# Altium project DykoDAC2.PrjPcb
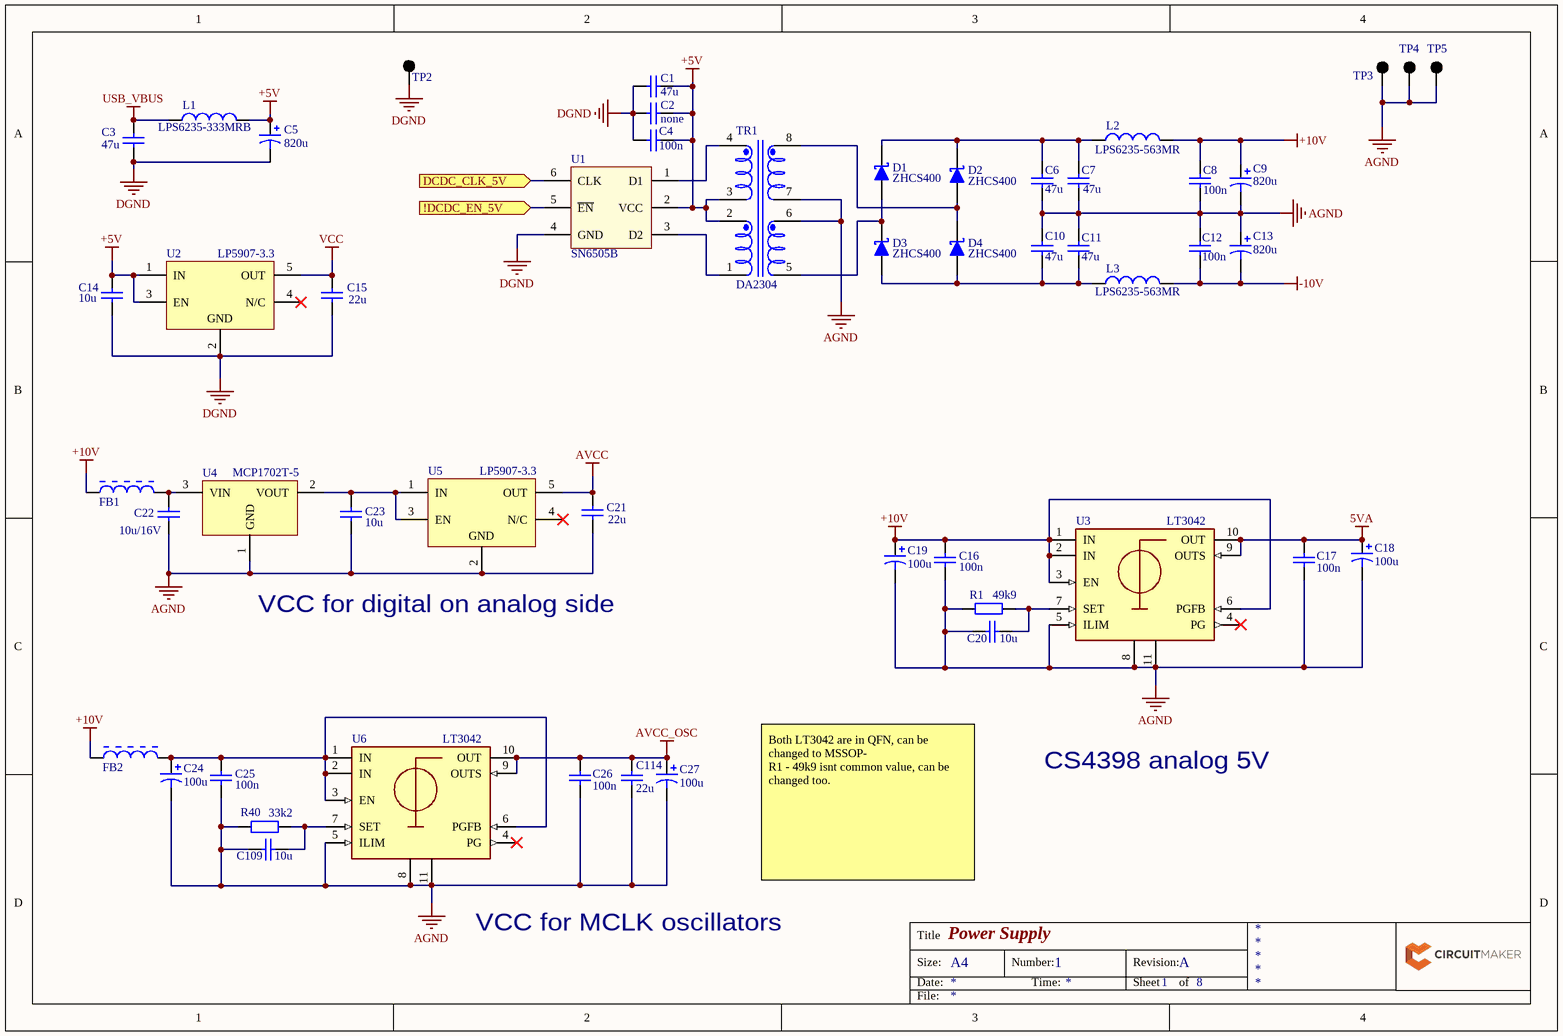
[diagram p0: Power_Supply.SchDoc]
8 sheets, 228 parts. Net scope: flat (ports and power ports of the same name join across sheets).
Sheets:
  Power_Supply.SchDoc
  Power_Supply_9V.SchDoc
  Comm_Interface.SchDoc
  MCU_System.SchDoc
  MCU_GPIO.SchDoc
  MCLK_Oscillator.SchDoc
  CS4398_DAC.SchDoc
  Audio_Output.SchDoc

## Sheet Power_Supply.SchDoc: Power Supply
size A4; DrawnBy: Tomáš Polišenský; DocumentNumber: 1; Revision: A; SheetNumber: 1; SheetTotal: 8; ProjectName: DykoDAC2

### Parts
C1  47u  [PCB-6alau6k4isvsg1wxu4va-1]
C2  none  [PCB-6alau6k4isvsg1wxu4va-1]
C3  47u  [PCB-6alau6k4isvsg1wxu4va-1]
C4  100n  [PCB-rf0pzaa82dpbeu9l4sxm-1]
C5  820u  [A750MS827M1CAAE013]
C6  47u  [PCB-6alau6k4isvsg1wxu4va-1]
C7  47u  [PCB-6alau6k4isvsg1wxu4va-1]
C8  100n  [PCB-rf0pzaa82dpbeu9l4sxm-1]
C9  820u  [A750MS827M1CAAE013]
C10  47u  [PCB-6alau6k4isvsg1wxu4va-1]
C11  47u  [PCB-6alau6k4isvsg1wxu4va-1]
C12  100n  [PCB-rf0pzaa82dpbeu9l4sxm-1]
C13  820u  [A750MS827M1CAAE013]
C14  10u  [PCB-rf0pzaa82dpbeu9l4sxm-1]
C15  22u  [PCB-rf0pzaa82dpbeu9l4sxm-1]
C16  100n  [PCB-rf0pzaa82dpbeu9l4sxm-1]
C17  100n  [PCB-rf0pzaa82dpbeu9l4sxm-1]
C18  100u  [PCB-9bfrndi9huxo1n7cihpl-1]
C19  100u  [PCB-9bfrndi9huxo1n7cihpl-1]
C20  10u  [PCB-rf0pzaa82dpbeu9l4sxm-1]
C21  22u  [PCB-rf0pzaa82dpbeu9l4sxm-1]
C22  10u/16V  [PCB-rf0pzaa82dpbeu9l4sxm-1]
C23  10u  [PCB-rf0pzaa82dpbeu9l4sxm-1]
C24  100u  [PCB-9bfrndi9huxo1n7cihpl-1]
C25  100n  [PCB-rf0pzaa82dpbeu9l4sxm-1]
C26  100n  [PCB-rf0pzaa82dpbeu9l4sxm-1]
C27  100u  [PCB-9bfrndi9huxo1n7cihpl-1]
C109  10u  [PCB-rf0pzaa82dpbeu9l4sxm-1]
C114  22u  [PCB-rf0pzaa82dpbeu9l4sxm-1]
D1  ZHCS400  [PCB-mrclmtn06znaca5ywvvw-1]
D2  ZHCS400  [PCB-mrclmtn06znaca5ywvvw-1]
D3  ZHCS400  [PCB-mrclmtn06znaca5ywvvw-1]
D4  ZHCS400  [PCB-mrclmtn06znaca5ywvvw-1]
FB1  BLM18EG391TN1D  [MURA-BLM18-F-H3-CHIP-2_V]  (value not drawn)
FB2  BLM18EG391TN1D  [MURA-BLM18-F-H3-CHIP-2_V]  (value not drawn)
L1  LPS6235-333MRB  [LPS6235]
L2  LPS6235-563MR  [PCB-91apuy3syfgd6vk6qbo6-1]
L3  LPS6235-563MR  [PCB-91apuy3syfgd6vk6qbo6-1]
R1  49k9  [PCB-3d5y3t7f8drf35yjcj59-1]
R40  33k2  [PCB-3d5y3t7f8drf35yjcj59-1]
TP2  Keystone Electronics 5001  [P1-09]  (value not drawn)
TP3  Keystone Electronics 5001  [P1-09]  (value not drawn)
TP4  Keystone Electronics 5001  [P1-09]  (value not drawn)
TP5  Keystone Electronics 5001  [P1-09]  (value not drawn)
TR1  DA2304  [PCB-wryx25zm61bkpund2vng-1]
U1  SN6505B  [PCB-z49b8x4xdp07datjgpqp-1]
U2  LP5907-3.3  [PCB-ab03it339uw922kmt1cl-1]
U3  LT3042  [PCB-n2zh5wqg9qgt346qmob6-1]
U4  MCP1702T-5  [SOT-23A-CB3_L]
U5  LP5907-3.3  [PCB-ab03it339uw922kmt1cl-1]
U6  LT3042  [PCB-n2zh5wqg9qgt346qmob6-1]

### Ports
!DCDC_EN_5V (in), DCDC_CLK_5V (in)

### Nets
5VA: C17.2 C18.1 U3.9(OUTS) U3.10(OUT)
+5V: C1.1 C2.1 C4.2 C5.1 C14.2 L1.2 TR1.2 TR1.3 U1.2(VCC) U2.1(IN) U2.3(EN)
+10V: C8.2 C9.1 C16.2 C19.1 FB1.1 FB2.1 L2.2 U3.1(IN) U3.2(IN) U3.3(EN) U3.6(PGFB)
-10V: C12.1 C13.2 L3.2
AGND: C6.1 C7.1 C8.1 C9.2 C10.2 C11.2 C12.2 C13.1 C16.1 C17.1 C18.2 C19.2 C20.2 C21.1 C22.1 C23.1 C24.2 C25.1 C26.1 C27.2 C109.2 C114.1 R1.2 R40.2 TP3.1 TP4.1 TP5.1 TR1.6 TR1.7 U3.5(ILIM) U3.8(GND) U3.11(GND) U4.1(GND) U5.2(GND) U6.5(ILIM) U6.8(GND) U6.11(GND)
AVCC: C21.2 U5.5(OUT)
AVCC_OSC: C26.2 C27.1 C114.2 U6.9(OUTS) U6.10(OUT)
DGND: C1.2 C2.2 C3.1 C4.1 C5.2 C14.1 C15.1 TP2.1 U1.4(GND) U2.2(GND)
USB_VBUS: C3.2 L1.1
VCC: C15.2 U2.5(OUT)
!DCDC_EN_5V: U1.5(~{EN}) ; port !DCDC_EN_5V
DCDC_CLK_5V: U1.6(CLK) ; port DCDC_CLK_5V
NetC6_2: C6.2 C7.2 D1.2(K) D2.2(K) L2.1
NetC10_1: C10.1 C11.1 D3.1(A) D4.1(A) L3.1
NetC20_1: C20.1 R1.1 U3.7(SET)
NetC22_2: C22.2 FB1.2 U4.3(VIN)
NetC23_2: C23.2 U4.2(VOUT) U5.1(IN) U5.3(EN)
NetC24_1: C24.1 C25.2 FB2.2 U6.1(IN) U6.2(IN) U6.3(EN) U6.6(PGFB)
NetC109_1: C109.1 R40.1 U6.7(SET)
NetD1_1: D1.1(A) D3.2(K) TR1.5
NetD2_1: D2.1(A) D4.2(K) TR1.8
NetTR1_1: TR1.1 U1.3(D2)
NetTR1_4: TR1.4 U1.1(D1)

Not connected (* = marked no-connect by the designer): U2 4(N/C)*; U3 4(PG)*; U5 4(N/C)*; U6 4(PG)*

### Notes on the sheet
- VCC for digital on analog side
- CS4398 analog 5V
- Both LT3042 are in QFN, can be changed to MSSOP-
  R1 - 49k9 isnt common value, can be changed too.
- (near U6) VCC for MCLK oscillators
- Title
- Size:
- Date:
- A4
- Number:
- Time:
- Revision:
- Sheet
- of
- File:

### Library data of the parts
C1-C3 C6 C7 C10 C11 = CMP-a2006a3718e57dc7-1: 1210 100 uF 16 V ±20% Tolerance X5R SMT Multilayer Ceramic Capacitor; Case/Package: 1210
C4 C8 C12 = CMP-x8hddryxw4o380xfi98v-3: Generic Capacitor 0603; CustomComponentID: x8hddryxw4o380xfi98v; LCSC Part #: C14663
C5 C9 C13 = CMP-1544d833d83eca83-8: Cap Aluminum Polymer 1000uF 16VDC 20% (10 X 12mm) Radial 5mm 0.013 Ohm 5250mA 2000h 105C Bag; Voltage Rating (DC): 16.0 V; Capacitance: 1.00 mF
C14-C17 C20-C23 C25 C26 C109 C114 = CMP-x8hddryxw4o380xfi98v-1: Capacitor 0603; CustomComponentID: x8hddryxw4o380xfi98v
  C14: LCSC Part #: C19702; LCSC Part #: C25804
  C15 C21 C114: LCSC Part #: C59461
  C16 C17 C25 C26: LCSC Part #: C14663
  C20 C23 C109: LCSC Part #: C19702
C18 C19 C24 C27 = CMP-6546a831a81eba81-4: In a Pack of 25, KEMET 100?F Electrolytic Capacitor 10V dc Through Hole - A758EK107M1AAAE016; Capacitance: 100 µF; Equivalent Series Resistance (ESR): 16.0 m?; Voltage Rating (DC): 10.0 V; Capacitance Tolerance: ±20%; Mounting Style: Through Hole; Size-Diameter: 6.30 mm; Size-Height: 8.00 mm; Operating Temperature: 105 °C (max); RoHS: Compliant; Manufacturer Part Number: A758EK107M1AAAE016; Octopart URL: https://octopart.com/a758ek107m1aaae016-kemet-75360318; OctopartID: 6546a831a81eba81
D1-D4 = CMP-3796931-5: Schottky Rectifier, 0.4A, 40V SOD-323; Power Rating: 250 mW; REACH SVHC Compliance: No SVHC; Packaging: Cut Tape (CT); Octopart URL: https://octopart.com/zhcs400-diodes+inc.-13152663; Case/Package: SOD-323; Lifecycle Status: Active; RoHS: Compliant; OctopartID: 21c3e801b532fe04; Manufacturer Part Number: ZHCS400
FB1 FB2 = CMP-1144711-3: Chip Ferrite Bead for GHz Band General Use (Low DC Resistance Type), 390 Ohm, 500 mA, -55 to 125 degC, 1.6 x 0.8 x 0.65 mm SMD, Tape and Reel; Lead-Free Status: Lead Free; Number of Circuits: 1; Resistance: 390.0 Ω; Shielding: No; Manufacturer Part Number: BLM18EG391TN1D; Case/Package: 0603; Mounting Style: Surface Mount; Number of Pins: 2; Octopart Url: https://octopart.com/blm18eg391tn1d-murata-894703; OctopartID: 5b48924fd8c1848f; Packaging: Cut Tape (CT); REACH SVHC Compliance: No SVHC; RoHS: Compliant; Size-Length: 0.0016 m; Size-Width: 0.0008 m
L1 = CMP-f5873d4763982a40-2: Power inductor, shielded, 20% tol, SMT, RoHS, lead-free, halogen-free
L2 L3 = CMP-db2813e84dcb04ef-1: Power inductor, shielded, 20% tol, SMT, RoHS, lead-free, halogen-free; Inductance: 56.0 µH; REACH SVHC Compliance: No SVHC; Packaging: Cut Tape (CT); Lifecycle Status: Active
R1 R40 = CMP-xcu3s4ikiffkkgbeyow5-1: Resistor 0603; CustomComponentID: xcu3s4ikiffkkgbeyow5
TP2-TP5 = CMP-954154-31: KEYSTONE   5001   TEST POINT, PCB, THROUGH HOLE
TR1 = CMP-7cc7b5ab862da300-5: Transformer, for ADM2485, 5-6V, SMT, RoHS; Manufacturer Part Number: DA2303-ALB; Lead-Free Status: Contains Lead; Lifecycle Status: Active; Mounting Style: Surface Mount; OctopartID: 7cc7b5ab862da300; RoHS: Compliant; Octopart URL: https://octopart.com/da2303-alb-coilcraft-6741900
U1 = CMP-a28c686de0427d4b-3: Low-Noise 1 A, 420 kHz Transformer Driver 6-SOT-23 -55 to 125; Manufacturer Part Number: SN6505BDBVT; Lead-Free Status: Lead Free; RoHS: Compliant; Packaging: Cut Tape (CT); Number of Pins: 6; Lifecycle Status: Active; Case/Package: SOT-23; Octopart URL: http://octopart.com/sn6505bdbvr-texas+instruments-65759143; OctopartID: 65ebaf0a272aba2c
U2 U5 = CMP-9de05591815b4227-2: 250mA Ultralow-Noise Low-IQ LDO 4-DSBGA -40 to 125; Manufacturer Part Number: LP5907UVX-3.3/NOPB; Number of Regulated Outputs: 1; Quiescent Current: 12.0 µA; Dropout Voltage: 50.0 mV; Lead-Free Status: Lead Free; Output Capacitor Type: Ceramic; Thermal Shutdown: Yes; RoHS: Compliant; OctopartID: 9de05591815b4227; Octopart URL: http://octopart.com/lp5907uvx-3.3%2Fnopb-texas+instruments-24852957; Lifecycle Status: Active; Packaging: Cut Tape (CT); Mounting Style: Surface Mount
U3 U6 = CMP-ff8235e0d3752045-3: LT3042 - 20V, 200mA, Ultralow Noise, Ultrahigh PSRR RF Linear Regulator; Manufacturer Part Number: LT3042EDD#PBF; Output Voltage: 0.00 V (min), 15.0 V (max); OctopartID: ff8235e0d3752045; Output Current: 200 mA; REACH SVHC Compliance: No SVHC; Octopart URL: http://octopart.com/lt3042edd%23pbf-linear+technology-57149841; RoHS: Compliant; Case/Package: DFN; Number of Pins: 10
U4 = CMP-1493251-3: 250 mA Low Quiescent Current LDO Regulator, 3-Pin SOT-23A, Extended Temperature, Tape and Reel; Manufacturer Part Number: MCP1702T-5002E/CB; Dropout Voltage: 0.625 V; Lead-Free Status: Lead Free; Number of Outputs: 1; Output Voltage: 5.0 V; Quiescent Current: 2e-06 A; Lifecycle Status: Active; Mounting Style: Surface Mount; Number of Pins: 3; Octopart Url: https://octopart.com/mcp1702t-5002e%2Fcb-microchip-535771; OctopartID: c0f809fac9451f3f; Packaging: Tape & Reel (TR); REACH SVHC Compliance: No SVHC; RoHS: Compliant

## Sheet Power_Supply_9V.SchDoc: +/- 9V LDOs
size A4; DocumentNumber: 2; SheetNumber: 2; SheetTotal: 8
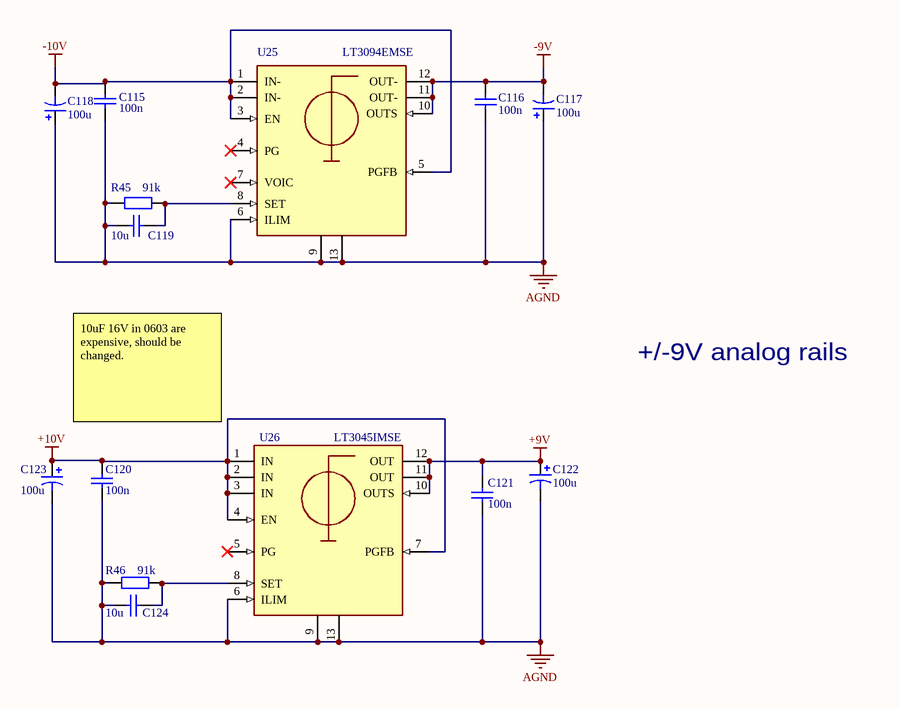
[diagram p1: Power_Supply_9V.SchDoc]

### Parts
C115  100n  [PCB-rf0pzaa82dpbeu9l4sxm-1]
C116  100n  [PCB-rf0pzaa82dpbeu9l4sxm-1]
C117  100u  [PCB-9bfrndi9huxo1n7cihpl-1]
C118  100u  [PCB-9bfrndi9huxo1n7cihpl-1]
C119  10u  [PCB-rf0pzaa82dpbeu9l4sxm-1]
C120  100n  [PCB-rf0pzaa82dpbeu9l4sxm-1]
C121  100n  [PCB-rf0pzaa82dpbeu9l4sxm-1]
C122  100u  [PCB-9bfrndi9huxo1n7cihpl-1]
C123  100u  [PCB-9bfrndi9huxo1n7cihpl-1]
C124  10u  [PCB-rf0pzaa82dpbeu9l4sxm-1]
R45  91k  [PCB-3d5y3t7f8drf35yjcj59-1]
R46  91k  [PCB-3d5y3t7f8drf35yjcj59-1]
U25  LT3094EMSE  [PCB-wizual0g3wynqnqrtsvy-1]
U26  LT3045IMSE  [PCB-wov5llpgebpq1pwypz48-1]

### Nets
+9V: C121.2 C122.1 U26.10(OUTS) U26.11(OUT) U26.12(OUT)
+10V: C120.2 C123.1 U26.1(IN) U26.2(IN) U26.3(IN) U26.4(EN) U26.7(PGFB)
-9V: C116.2 C117.2 U25.10(OUTS) U25.11(OUT-) U25.12(OUT-)
-10V: C115.2 C118.2 U25.1(IN-) U25.2(IN-) U25.3(EN) U25.5(PGFB)
AGND: C115.1 C116.1 C117.1 C118.1 C119.2 C120.1 C121.1 C122.2 C123.2 C124.2 R45.2 R46.2 U25.6(ILIM) U25.9(GND) U25.13(GND) U26.6(ILIM) U26.9(GND) U26.13(GND)
NetC119_1: C119.1 R45.1 U25.8(SET)
NetC124_1: C124.1 R46.1 U26.8(SET)

Not connected (* = marked no-connect by the designer): U25 4(PG)* 7(VOIC)*; U26 5(PG)*

### Notes on the sheet
- 10uF 16V in 0603 are expensive, should be changed.
- +/-9V analog rails
- Title
- Size:
- Date:
- A4
- Number:
- Time:
- Revision:
- Sheet
- of
- File:

### Library data of the parts
C115 C116 C119-C121 C124 = CMP-x8hddryxw4o380xfi98v-1: Capacitor 0603; CustomComponentID: x8hddryxw4o380xfi98v; LCSC Part #: C19702
  C115 C116 C120 C121: LCSC Part #: C14663; LCSC Part #: C109474
  C119 C124: LCSC Part #: C25804; LCSC Part #: C21190; LCSC Part #: C81598; LCSC Part #: C1546
C117 C118 C122 C123 = CMP-6546a831a81eba81-4: as C18 on sheet Power_Supply; Mounting Style: Through Hole; Size-Diameter: 6.30 mm; Size-Height: 8.00 mm; Operating Temperature: 105 °C (max); RoHS: Compliant; Manufacturer Part Number: A758EK107M1AAAE016; Octopart URL: https://octopart.com/a758ek107m1aaae016-kemet-75360318; OctopartID: 6546a831a81eba81
R45 R46 = CMP-xcu3s4ikiffkkgbeyow5-1: Resistor 0603; CustomComponentID: xcu3s4ikiffkkgbeyow5; LCSC Part #: C23265; LCSC Part #: C23345
U25 = CMP-cc5900e31f81139e-11: LDO Regulator Neg 0V to -19.5V 0.5A 12-Pin MSOP EP Tube; Manufacturer Part Number: LT3094EMSE#PBF; Lead-Free Status: Contains Lead; Octopart URL: https://octopart.com/lt3094emse%23pbf-analog+devices-95403590; Number of Pins: 12; Lifecycle Status: Active; RoHS: Compliant; OctopartID: a88b642e33ab774c
U26 = CMP-53899e0384ae8c4e-10: LDO Regulator Pos 0V to 20V 0.5A Automotive 12-Pin MSOP EP Tube; Manufacturer Part Number: LT3045IMSE#PBF; Lead-Free Status: Contains Lead; Output Current: 500 mA; RoHS: Compliant; OctopartID: 53899e0384ae8c4e; Octopart URL: https://octopart.com/lt3045imse%23pbf-analog+devices+%2F+linear+technology-75559489; Lifecycle Status: Active; Operating Temperature: -40.0 °C (min); Case/Package: MSOP; Number of Pins: 12

## Sheet Comm_Interface.SchDoc: Control Interface
size A4; DocumentNumber: 3; SheetNumber: 3; SheetTotal: 8
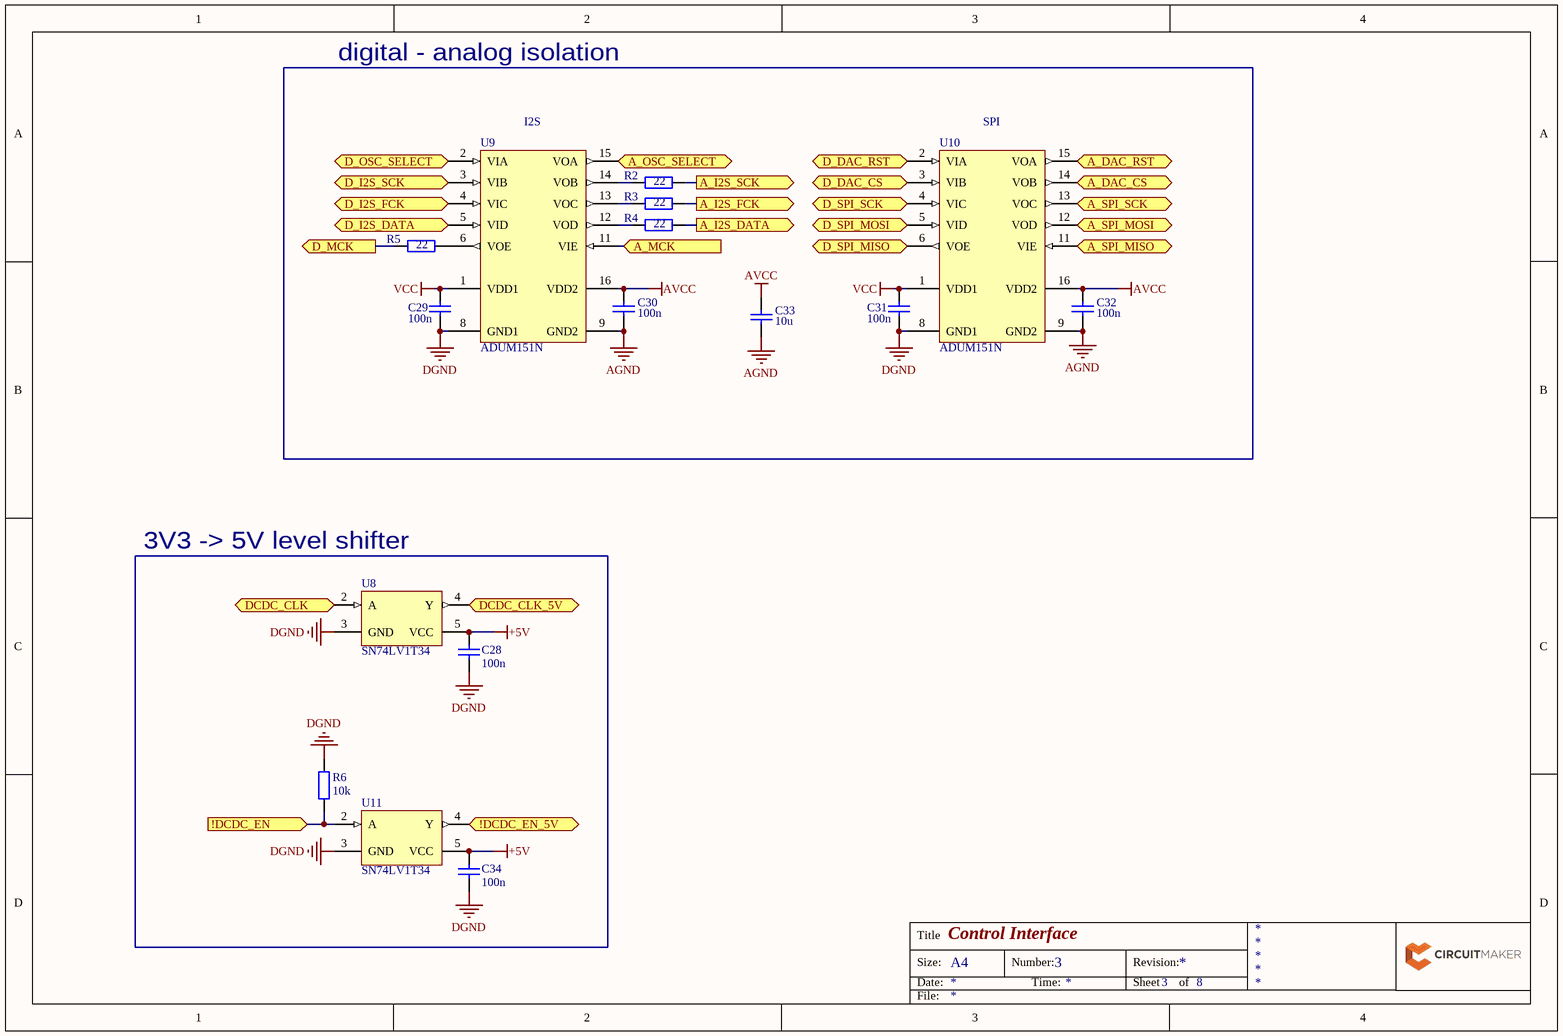
[diagram p2: Comm_Interface.SchDoc]

### Parts
C28  100n  [PCB-rf0pzaa82dpbeu9l4sxm-1]
C29  100n  [PCB-rf0pzaa82dpbeu9l4sxm-1]
C30  100n  [PCB-rf0pzaa82dpbeu9l4sxm-1]
C31  100n  [PCB-rf0pzaa82dpbeu9l4sxm-1]
C32  100n  [PCB-rf0pzaa82dpbeu9l4sxm-1]
C33  10u  [PCB-rf0pzaa82dpbeu9l4sxm-1]
C34  100n  [PCB-rf0pzaa82dpbeu9l4sxm-1]
R2  22  [PCB-3d5y3t7f8drf35yjcj59-1]
R3  22  [PCB-3d5y3t7f8drf35yjcj59-1]
R4  22  [PCB-3d5y3t7f8drf35yjcj59-1]
R5  22  [PCB-3d5y3t7f8drf35yjcj59-1]
R6  10k  [PCB-3d5y3t7f8drf35yjcj59-1]
U8  SN74LV1T34  [PCB-0ardthfs7lzl2yengne1-1]
U9  ADUM151N  [SOP16]
U10  ADUM151N  [SOP16]
U11  SN74LV1T34  [PCB-0ardthfs7lzl2yengne1-1]

### Blocks framed on the sheet
digital - analog isolation: C29-C33 R2-R5 U9 U10
3V3 -> 5V level shifter: C28 C34 R6 U8 U11

### Ports
!DCDC_EN (in), !DCDC_EN_5V (out), A_DAC_CS (out), A_DAC_RST (out), A_I2S_DATA (out), A_I2S_FCK (out), A_I2S_SCK (out), A_MCK (in), A_OSC_SELECT (out), A_SPI_MISO (in), A_SPI_MOSI (out), A_SPI_SCK (out), D_DAC_CS (in), D_DAC_RST (in), D_I2S_DATA (in), D_I2S_FCK (in), D_I2S_SCK (in), D_MCK (out), D_OSC_SELECT (in), D_SPI_MISO (out), D_SPI_MOSI (in), D_SPI_SCK (in), DCDC_CLK (in), DCDC_CLK_5V (out)

### Nets
+5V: C28.2 C34.2 U8.5(VCC) U11.5(VCC)
AGND: C30.1 C32.1 C33.1 U9.9(GND2) U10.9(GND2)
AVCC: C30.2 C32.2 C33.2 U9.16(VDD2) U10.16(VDD2)
DGND: C28.1 C29.1 C31.1 C34.1 R6.2 U8.3(GND) U9.8(GND1) U10.8(GND1) U11.3(GND)
VCC: C29.2 C31.2 U9.1(VDD1) U10.1(VDD1)
!DCDC_EN: R6.1 U11.2(A) ; port !DCDC_EN
!DCDC_EN_5V: U11.4(Y) ; port !DCDC_EN_5V
A_DAC_CS: U10.14(VOB) ; port A_DAC_CS
A_DAC_RST: U10.15(VOA) ; port A_DAC_RST
A_I2S_DATA: R4.1 ; port A_I2S_DATA
A_I2S_FCK: R3.1 ; port A_I2S_FCK
A_I2S_SCK: R2.1 ; port A_I2S_SCK
A_MCK: U9.11(VIE) ; port A_MCK
A_OSC_SELECT: U9.15(VOA) ; port A_OSC_SELECT
A_SPI_MISO: U10.11(VIE) ; port A_SPI_MISO
A_SPI_MOSI: U10.12(VOD) ; port A_SPI_MOSI
A_SPI_SCK: U10.13(VOC) ; port A_SPI_SCK
D_DAC_CS: U10.3(VIB) ; port D_DAC_CS
D_DAC_RST: U10.2(VIA) ; port D_DAC_RST
D_I2S_DATA: U9.5(VID) ; port D_I2S_DATA
D_I2S_FCK: U9.4(VIC) ; port D_I2S_FCK
D_I2S_SCK: U9.3(VIB) ; port D_I2S_SCK
D_MCK: R5.2 ; port D_MCK
D_OSC_SELECT: U9.2(VIA) ; port D_OSC_SELECT
D_SPI_MISO: U10.6(VOE) ; port D_SPI_MISO
D_SPI_MOSI: U10.5(VID) ; port D_SPI_MOSI
D_SPI_SCK: U10.4(VIC) ; port D_SPI_SCK
DCDC_CLK: U8.2(A) ; port DCDC_CLK
DCDC_CLK_5V: U8.4(Y) ; port DCDC_CLK_5V
NetR2_2: R2.2 U9.14(VOB)
NetR3_2: R3.2 U9.13(VOC)
NetR4_2: R4.2 U9.12(VOD)
NetR5_1: R5.1 U9.6(VOE)

### Notes on the sheet
- (near U9) I2S
- (near U10) SPI
- Title
- Size:
- Date:
- A4
- Number:
- Time:
- Revision:
- Sheet
- of
- File:

### Library data of the parts
C28-C34 = CMP-x8hddryxw4o380xfi98v-1: Capacitor 0603; CustomComponentID: x8hddryxw4o380xfi98v; LCSC Part #: C19702
  C28-C32 C34: LCSC Part #: C14663; LCSC Part #: C109474
R2-R6 = CMP-xcu3s4ikiffkkgbeyow5-1: Resistor 0603; CustomComponentID: xcu3s4ikiffkkgbeyow5
  R2-R5: LCSC Part #: C23345
  R6: LCSC Part #: C25804; LCSC Part #: C19702; LCSC Part #: C21190; LCSC Part #: C81598; LCSC Part #: C1546; LCSC Part #: C23265
U8 U11 = CMP-3a3bf2ca9c96e5fc-1: Single Power Supply BUFFER Logic Level Shifter (no enable) 5-SC70 -40 to 125; Manufacturer Part Number: SN74LV1T34DCKR; Lead-Free Status: Lead Free; Octopart URL: http://octopart.com/sn74lv1t34dckr-texas+instruments-33260491; Lifecycle Status: Active; RoHS: Compliant; OctopartID: 3a3bf2ca9c96e5fc
U9 U10 = CMP-8a0e4768d24455c9-3: Digital Isolator CMOS 5-CH 150Mbps 16-Pin SOIC N Tube; Lead-Free Status: Contains Lead; Number of Pins: 16; Octopart URL: https://octopart.com/adum151n0brz-analog+devices-74218796; RoHS: Compliant; Lifecycle Status: Pre-Release; OctopartID: 8a0e4768d24455c9; Operating Temperature: -40.0 °C (min); Packaging: Tube

## Sheet MCU_System.SchDoc: MCU Power & Clocks
size A4; DocumentNumber: 4; SheetNumber: 4; SheetTotal: 8
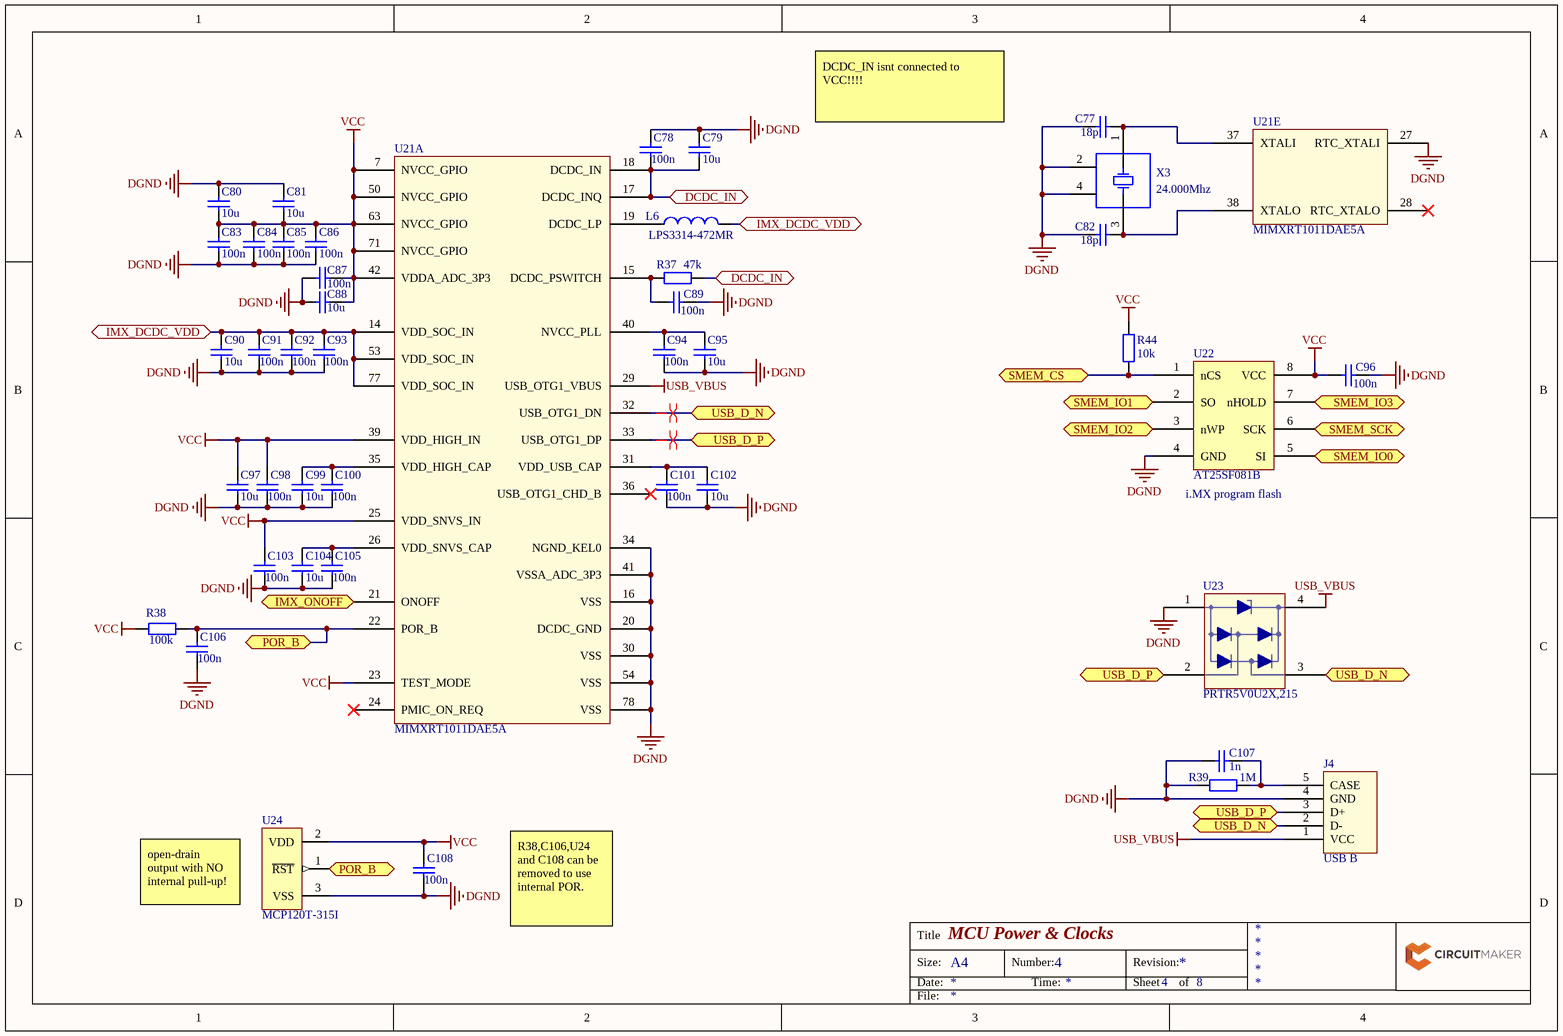
[diagram p3: MCU_System.SchDoc]

### Parts
C77  18p  [PCB-rf0pzaa82dpbeu9l4sxm-1]
C78  100n  [PCB-rf0pzaa82dpbeu9l4sxm-1]
C79  10u  [PCB-rf0pzaa82dpbeu9l4sxm-1]
C80  10u  [PCB-rf0pzaa82dpbeu9l4sxm-1]
C81  10u  [PCB-rf0pzaa82dpbeu9l4sxm-1]
C82  18p  [PCB-rf0pzaa82dpbeu9l4sxm-1]
C83  100n  [PCB-rf0pzaa82dpbeu9l4sxm-1]
C84  100n  [PCB-rf0pzaa82dpbeu9l4sxm-1]
C85  100n  [PCB-rf0pzaa82dpbeu9l4sxm-1]
C86  100n  [PCB-rf0pzaa82dpbeu9l4sxm-1]
C87  100n  [PCB-rf0pzaa82dpbeu9l4sxm-1]
C88  10u  [PCB-rf0pzaa82dpbeu9l4sxm-1]
C89  100n  [PCB-rf0pzaa82dpbeu9l4sxm-1]
C90  10u  [PCB-rf0pzaa82dpbeu9l4sxm-1]
C91  100n  [PCB-rf0pzaa82dpbeu9l4sxm-1]
C92  100n  [PCB-rf0pzaa82dpbeu9l4sxm-1]
C93  100n  [PCB-rf0pzaa82dpbeu9l4sxm-1]
C94  100n  [PCB-rf0pzaa82dpbeu9l4sxm-1]
C95  10u  [PCB-rf0pzaa82dpbeu9l4sxm-1]
C96  100n  [PCB-rf0pzaa82dpbeu9l4sxm-1]
C97  10u  [PCB-rf0pzaa82dpbeu9l4sxm-1]
C98  100n  [PCB-rf0pzaa82dpbeu9l4sxm-1]
C99  10u  [PCB-rf0pzaa82dpbeu9l4sxm-1]
C100  100n  [PCB-rf0pzaa82dpbeu9l4sxm-1]
C101  100n  [PCB-rf0pzaa82dpbeu9l4sxm-1]
C102  10u  [PCB-rf0pzaa82dpbeu9l4sxm-1]
C103  100n  [PCB-rf0pzaa82dpbeu9l4sxm-1]
C104  10u  [PCB-rf0pzaa82dpbeu9l4sxm-1]
C105  100n  [PCB-rf0pzaa82dpbeu9l4sxm-1]
C106  100n  [PCB-rf0pzaa82dpbeu9l4sxm-1]
C107  1n  [PCB-rf0pzaa82dpbeu9l4sxm-1]
C108  100n  [PCB-rf0pzaa82dpbeu9l4sxm-1]
J4  USB B  [PCB-zpxmgbfbf2leld1qryc0-1]
L6  LPS3314-472MR  [PCB-ugv71n5f75k2fx4txc2r-1]
R37  47k  [PCB-3d5y3t7f8drf35yjcj59-1]
R38  100k  [PCB-3d5y3t7f8drf35yjcj59-1]
R39  1M  [PCB-3d5y3t7f8drf35yjcj59-1]
R44  10k  [PCB-3d5y3t7f8drf35yjcj59-1]
U21  MIMXRT1011DAE5A  [PCB-9tw520wec8sfx58i85wg-1]  (parts A,E of 5)
U22  AT25SF081B  [PCBComponent_1]
U23  PRTR5V0U2X,215  [SOT143-4L]
U24  MCP120T-315I  [SOT-23-TT3_N]
X3  24.000Mhz  [PCB-pzpexmpe4kdarfiuuki7-1]

### Ports
DCDC_IN, IMX_DCDC_VDD, IMX_ONOFF (in), POR_B, SMEM_CS, SMEM_IO0, SMEM_IO1, SMEM_IO2, SMEM_IO3, SMEM_SCK, USB_D_N (bidir), USB_D_P (bidir)

### Nets
DGND: C77.2 C78.1 C79.2 C80.2 C81.2 C82.2 C83.1 C84.1 C85.1 C86.1 C87.2 C88.2 C89.2 C90.1 C91.2 C92.2 C93.2 C94.2 C95.1 C96.2 C97.1 C98.2 C99.1 C100.2 C101.2 C102.1 C103.2 C104.1 C105.2 C106.2 C107.1 C108.2 J4.4(GND) R39.1 U21.16(VSS) U21.20(DCDC_GND) U21.27(RTC_XTALI) U21.30(VSS) U21.34(NGND_KEL0) U21.41(VSSA_ADC_3P3) U21.54(VSS) U21.78(VSS) U22.4(GND) U23.1(GND) U24.3(VSS) X3.2 X3.4
USB_VBUS: J4.1(VCC) U21.29(USB_OTG1_VBUS) U23.4(VCC)
VCC: C80.1 C81.1 C83.2 C84.2 C85.2 C86.2 C87.1 C88.1 C96.1 C97.2 C98.1 C103.1 C108.1 R38.1 R44.2 U21.7(NVCC_GPIO) U21.23(TEST_MODE) U21.25(VDD_SNVS_IN) U21.39(VDD_HIGH_IN) U21.42(VDDA_ADC_3P3) U21.50(NVCC_GPIO) U21.63(NVCC_GPIO) U21.71(NVCC_GPIO) U22.8(VCC) U24.2(VDD)
DCDC_IN: C78.2 C79.1 R37.2 U21.17(DCDC_INQ) U21.18(DCDC_IN) ; port DCDC_IN
IMX_DCDC_VDD: C90.2 C91.1 C92.1 C93.1 L6.2 U21.14(VDD_SOC_IN) U21.53(VDD_SOC_IN) U21.77(VDD_SOC_IN) ; port IMX_DCDC_VDD
IMX_ONOFF: U21.21(ONOFF) ; port IMX_ONOFF
POR_B: C106.1 R38.2 U21.22(POR_B) U24.1(~{RST}) ; port POR_B
SMEM_CS: R44.1 U22.1(nCS) ; port SMEM_CS
SMEM_IO0: U22.5(SI) ; port SMEM_IO0
SMEM_IO1: U22.2(SO) ; port SMEM_IO1
SMEM_IO2: U22.3(nWP) ; port SMEM_IO2
SMEM_IO3: U22.7(nHOLD) ; port SMEM_IO3
SMEM_SCK: U22.6(SCK) ; port SMEM_SCK
USB_D_N: J4.2(D-) U21.32(USB_OTG1_DN) U23.3(I/O2) ; port USB_D_N
USB_D_P: J4.3(D+) U21.33(USB_OTG1_DP) U23.2(I/O1) ; port USB_D_P
NetC77_1: C77.1 U21.37(XTALI) X3.1
NetC82_1: C82.1 U21.38(XTALO) X3.3
NetC89_1: C89.1 R37.1 U21.15(DCDC_PSWITCH)
NetC94_1: C94.1 C95.2 U21.40(NVCC_PLL)
NetC99_2: C99.2 C100.1 U21.35(VDD_HIGH_CAP)
NetC101_1: C101.1 C102.2 U21.31(VDD_USB_CAP)
NetC104_2: C104.2 C105.1 U21.26(VDD_SNVS_CAP)
NetC107_2: C107.2 J4.5(CASE) R39.2
NetL6_1: L6.1 U21.19(DCDC_LP)

Not connected (* = marked no-connect by the designer): U21 24(PMIC_ON_REQ)* 28(RTC_XTALO)* 36(USB_OTG1_CHD_B)*

### Layout directives
differential pair: USB_D_N, USB_D_P

### Notes on the sheet
- DCDC_IN isnt connected to VCC!!!!
- (near U22) i.MX program flash
- open-drain output with NO internal pull-up!
- R38,C106,U24 and C108 can be removed to use internal POR.
- Title
- Size:
- Date:
- A4
- Number:
- Time:
- Revision:
- Sheet
- of
- File:

### Library data of the parts
C77-C108 = CMP-x8hddryxw4o380xfi98v-3: Generic Capacitor 0603; CustomComponentID: x8hddryxw4o380xfi98v
  C77 C82: LCSC Part #: C1679
  C78 C83-C87 C89 C91-C94 C96 C98 C100 C101 C103 C105 C106 C108: LCSC Part #: C14663; LCSC Part #: C109474
  C79-C81 C88 C90 C95 C97 C99 C102 C104: LCSC Part #: C19702; LCSC Part #: C25804
J4 = CMP-fd69346713c422ae-3: Conn.; Data; USB; Recept.; Shielded; Type B; Rt. Angle; w/Kinked Solder Tabs; White
L6 = CMP-54009cc0c0b08bc7-3: Power inductor, shielded, 20% tol, SMT, RoHS, lead-free; Manufacturer Part Number: LPS3314-824MRB; Inductance: 820 µH; Lead-Free Status: Contains Lead; RoHS: Compliant; Mounting Style: Surface Mount; REACH SVHC Compliance: No SVHC; Lifecycle Status: Active; OctopartID: 54009cc0c0b08bc7; Octopart URL: http://octopart.com/lps3314-824mrb-coilcraft-30061014
R37-R39 R44 = CMP-xcu3s4ikiffkkgbeyow5-1: Resistor 0603; CustomComponentID: xcu3s4ikiffkkgbeyow5
  R37: LCSC Part #: C25819
  R38: LCSC Part #: C25803
  R39: LCSC Part #: C22935
  R44: LCSC Part #: C25804; LCSC Part #: C19702; LCSC Part #: C21190; LCSC Part #: C81598; LCSC Part #: C1546; LCSC Part #: C23265; LCSC Part #: C23345
U21 = MIMXRT1011DAE5A: i.MX RT1011: 3.3 V 500 MHz 1 Core SMT 32-Bit Microprocessor IC - LQFP-80; OctopartID: 6e97a1b3b0b6b150; Manufacturer Part Number: MIMXRT1011DAE5A; Lifecycle Status: Not Listed by Manufacturer
U22 = CMP-7717bccd277da8d0-2: AT25SF161 Series 16 Mb (2 M x 8) 3.6 V SMT SPI Serial Flash Memory - SOIC-8; Manufacturer Part Number: AT25SF161-SSHD-T; Memory Size: 2000000 B; Lead-Free Status: Lead Free; Clock Speed: 104 MHz; Operating Temperature: -40.0 °C (min); Mounting Style: Surface Mount; RoHS: Compliant; OctopartID: 7717bccd277da8d0; Octopart URL: https://octopart.com/at25sf161-sshd-t-adesto+technologies-47215884
U23 = CMP-282990-4: PRTR5V0U2X - Ultra low capacitance double rail-to-rail ESD protection diode; Lifecycle Status: Active
U24 = CMP-981014-2: Microcontroller Supervisory Circuit with Push-Pull Output, 3-Pin SOT-23, Industrial Temperature, Tape and Reel; Manufacturer Part Number: MCP100T-315I/TT; Lead-Free Status: Lead Free; Quiescent Current: 4.5e-05 A; Threshold Voltage: 3.075 V; Case/Package: SOT-23; Lifecycle Status: Active; Mounting Style: Surface Mount; Number of Pins: 3; Octopart Url: https://octopart.com/mcp100t-315i%2Ftt-microchip-509982; OctopartID: f7583e551a20289f; REACH SVHC Compliance: No SVHC; RoHS: Compliant; Supply Current: 4.5e-05 A
X3 = CMP-096fc17935b7d6a8-2: Ember Chipset Crystal 565-2400-000, 24.000Mhz, 18Pf, 10Ppm@25C, 25Ppm-40+85C 3.2 X 2.5 X 0.70Mm / Tape & Reel; Load Capacitance: 18.0 pF; Packaging: Tape & Reel (TR)

## Sheet MCU_GPIO.SchDoc: MCU Gpio
size A4; DocumentNumber: 5; SheetNumber: 5; SheetTotal: 8
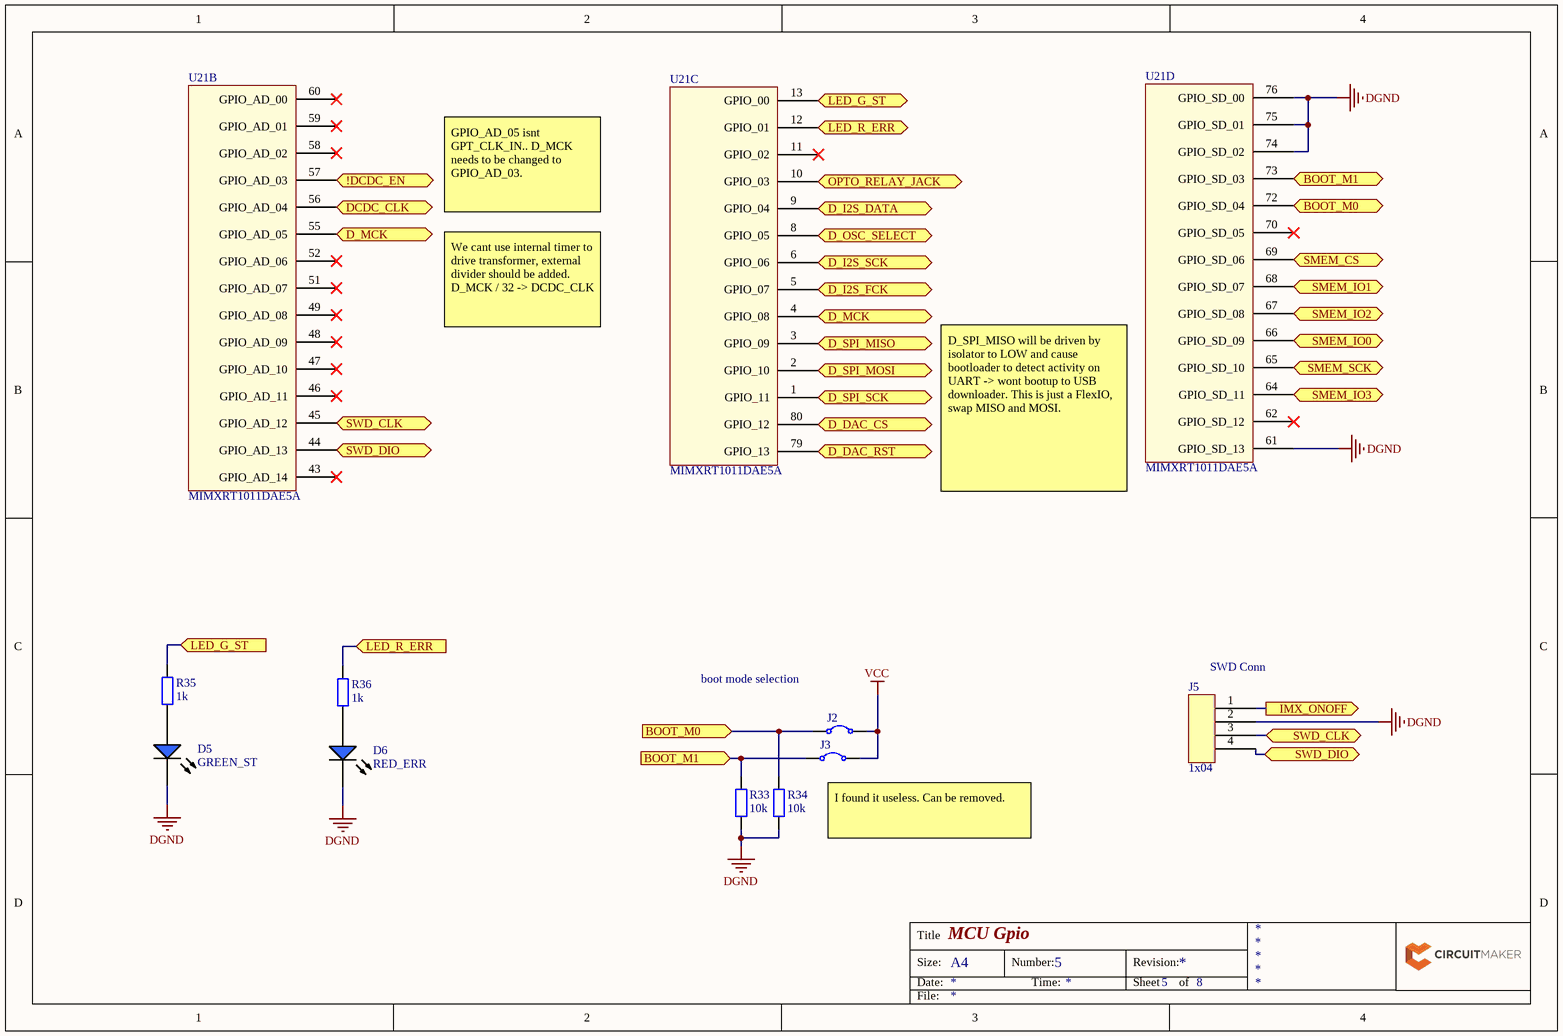
[diagram p4: MCU_GPIO.SchDoc]

### Parts
D5  GREEN_ST  [PCB-iuhwubou6tsv2qadu19r-1]
D6  RED_ERR  [PCB-iuhwubou6tsv2qadu19r-1]
J2  3M 923345-03-C  [PCB-ha706v9ghebje50nqhkf-1]  (value not drawn)
J3  3M 923345-03-C  [PCB-ha706v9ghebje50nqhkf-1]  (value not drawn)
J5  1x04  [PCB-w7fgx0p37qyww1etoafk-1]
R33  10k  [PCB-3d5y3t7f8drf35yjcj59-1]
R34  10k  [PCB-3d5y3t7f8drf35yjcj59-1]
R35  1k  [PCB-3d5y3t7f8drf35yjcj59-1]
R36  1k  [PCB-3d5y3t7f8drf35yjcj59-1]
U21  MIMXRT1011DAE5A  [PCB-9tw520wec8sfx58i85wg-1]  (parts B,C,D of 5)

### Ports
!DCDC_EN (out), BOOT_M0 (in), BOOT_M1 (in), D_DAC_CS (out), D_DAC_RST (out), D_I2S_DATA (out), D_I2S_FCK (out), D_I2S_SCK (out), D_MCK (in), D_OSC_SELECT (out), D_SPI_MISO (in), D_SPI_MOSI (out), D_SPI_SCK (out), DCDC_CLK (out), IMX_ONOFF (out), LED_G_ST (in), LED_G_ST (out), LED_R_ERR (in), LED_R_ERR (out), OPTO_RELAY_JACK (out), SMEM_CS, SMEM_IO0, SMEM_IO1, SMEM_IO2, SMEM_IO3, SMEM_SCK, SWD_CLK (bidir), SWD_DIO (bidir)

### Nets
DGND: D5.2(K) D6.2(K) J5.2 R33.2 R34.2 U21.61(GPIO_SD_13) U21.74(GPIO_SD_02) U21.75(GPIO_SD_01) U21.76(GPIO_SD_00)
VCC: J2.2 J3.2
!DCDC_EN: U21.57(GPIO_AD_03) ; port !DCDC_EN
BOOT_M0: J2.1 R34.1 U21.72(GPIO_SD_04) ; port BOOT_M0
BOOT_M1: J3.1 R33.1 U21.73(GPIO_SD_03) ; port BOOT_M1
D_DAC_CS: U21.80(GPIO_12) ; port D_DAC_CS
D_DAC_RST: U21.79(GPIO_13) ; port D_DAC_RST
D_I2S_DATA: U21.9(GPIO_04) ; port D_I2S_DATA
D_I2S_FCK: U21.5(GPIO_07) ; port D_I2S_FCK
D_I2S_SCK: U21.6(GPIO_06) ; port D_I2S_SCK
D_MCK: U21.4(GPIO_08) U21.55(GPIO_AD_05) ; port D_MCK
D_OSC_SELECT: U21.8(GPIO_05) ; port D_OSC_SELECT
D_SPI_MISO: U21.3(GPIO_09) ; port D_SPI_MISO
D_SPI_MOSI: U21.2(GPIO_10) ; port D_SPI_MOSI
D_SPI_SCK: U21.1(GPIO_11) ; port D_SPI_SCK
DCDC_CLK: U21.56(GPIO_AD_04) ; port DCDC_CLK
IMX_ONOFF: J5.1 ; port IMX_ONOFF
LED_G_ST: R35.1 U21.13(GPIO_00) ; port LED_G_ST
LED_R_ERR: R36.1 U21.12(GPIO_01) ; port LED_R_ERR
OPTO_RELAY_JACK: U21.10(GPIO_03) ; port OPTO_RELAY_JACK
SMEM_CS: U21.69(GPIO_SD_06) ; port SMEM_CS
SMEM_IO0: U21.66(GPIO_SD_09) ; port SMEM_IO0
SMEM_IO1: U21.68(GPIO_SD_07) ; port SMEM_IO1
SMEM_IO2: U21.67(GPIO_SD_08) ; port SMEM_IO2
SMEM_IO3: U21.64(GPIO_SD_11) ; port SMEM_IO3
SMEM_SCK: U21.65(GPIO_SD_10) ; port SMEM_SCK
SWD_CLK: J5.3 U21.45(GPIO_AD_12) ; port SWD_CLK
SWD_DIO: J5.4 U21.44(GPIO_AD_13) ; port SWD_DIO
NetD5_1: D5.1(A) R35.2
NetD6_1: D6.1(A) R36.2

Not connected (* = marked no-connect by the designer): U21 11(GPIO_02)* 43(GPIO_AD_14)* 46(GPIO_AD_11)* 47(GPIO_AD_10)* 48(GPIO_AD_09)* 49(GPIO_AD_08)* 51(GPIO_AD_07)* 52(GPIO_AD_06)* 58(GPIO_AD_02)* 59(GPIO_AD_01)* 60(GPIO_AD_00)* 62(GPIO_SD_12)* 70(GPIO_SD_05)*

### Notes on the sheet
- GPIO_AD_05 isnt GPT_CLK_IN.. D_MCK needs to be changed to GPIO_AD_03.
- We cant use internal timer to drive transformer, external divider should be added. D_MCK / 32 -> DCDC_CLK
- D_SPI_MISO will be driven by isolator to LOW and cause bootloader to detect activity on UART -> wont bootup to USB  downloader. This is just a FlexIO, swap MISO and MOSI.
- boot mode selection
- (near J5) SWD Conn
- (near J3) I found it useless. Can be removed.
- Title
- Size:
- Date:
- A4
- Number:
- Time:
- Revision:
- Sheet
- of
- File:

### Library data of the parts
D5 D6 = CMP-3013fb4020e1efd4-7: LED; Red; 1.2mcd; 3.2mmDia.; T-1; 7mA; 1.9V; 635nm; +/-25deg; GaAsP on GaP; 15V; Voltage Rating (DC): 1.90 V; Color: Blue; RoHS: Compliant; Packaging: Bulk; Operating Temperature: -40.0 °C (min); Size-Diameter: 3.20 mm
J2 J3 = CMP-s51b8wf5jcfui9wi7awt-5: SMD Jumper
J5 = CMP-4df18464dcf59236-4: Conn Unshrouded Header HDR 4 POS 2.54mm Solder ST Thru-Hole KK?? Bag; Manufacturer Part Number: 0022032041; RoHS: Compliant; OctopartID: 4df18464dcf59236; Octopart URL: http://octopart.com/0022032041-molex-10466402; Lifecycle Status: Not Listed by Manufacturer
R33-R36 = CMP-xcu3s4ikiffkkgbeyow5-1: Resistor 0603; CustomComponentID: xcu3s4ikiffkkgbeyow5
  R33 R34: LCSC Part #: C25804
  R35: LCSC Part #: C21190; LCSC Part #: C81598; LCSC Part #: C1546; LCSC Part #: C23265; LCSC Part #: C23345
  R36: LCSC Part #: C21190
U21 = MIMXRT1011DAE5A: as U21 on sheet MCU_System; OctopartID: 6e97a1b3b0b6b150; Manufacturer Part Number: MIMXRT1011DAE5A; Lifecycle Status: Not Listed by Manufacturer

## Sheet MCLK_Oscillator.SchDoc: MCLK Oscillator
size A4; DocumentNumber: 6; SheetNumber: 6; SheetTotal: 8
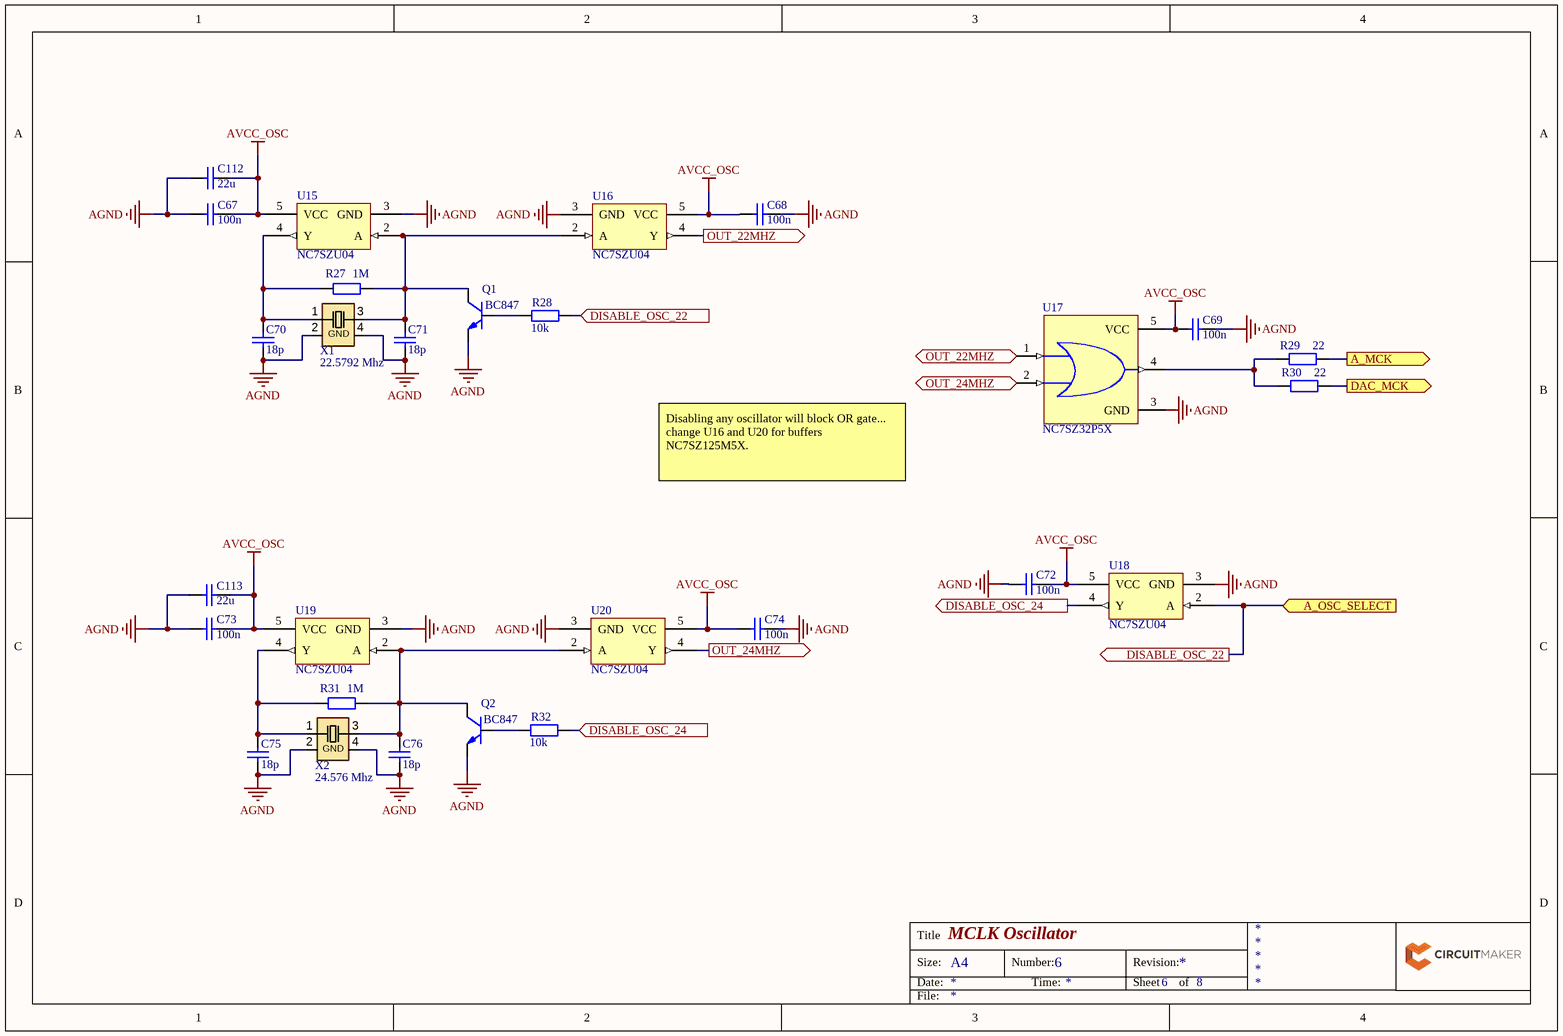
[diagram p5: MCLK_Oscillator.SchDoc]

### Parts
C67  100n  [PCB-rf0pzaa82dpbeu9l4sxm-1]
C68  100n  [PCB-rf0pzaa82dpbeu9l4sxm-1]
C69  100n  [PCB-rf0pzaa82dpbeu9l4sxm-1]
C70  18p  [PCB-rf0pzaa82dpbeu9l4sxm-1]
C71  18p  [PCB-rf0pzaa82dpbeu9l4sxm-1]
C72  100n  [PCB-rf0pzaa82dpbeu9l4sxm-1]
C73  100n  [PCB-rf0pzaa82dpbeu9l4sxm-1]
C74  100n  [PCB-rf0pzaa82dpbeu9l4sxm-1]
C75  18p  [PCB-rf0pzaa82dpbeu9l4sxm-1]
C76  18p  [PCB-rf0pzaa82dpbeu9l4sxm-1]
C112  22u  [PCB-rf0pzaa82dpbeu9l4sxm-1]
C113  22u  [PCB-rf0pzaa82dpbeu9l4sxm-1]
Q1  BC847  [SOT23-BEC]
Q2  BC847  [SOT23-BEC]
R27  1M  [PCB-3d5y3t7f8drf35yjcj59-1]
R28  10k  [PCB-3d5y3t7f8drf35yjcj59-1]
R29  22  [PCB-3d5y3t7f8drf35yjcj59-1]
R30  22  [PCB-3d5y3t7f8drf35yjcj59-1]
R31  1M  [PCB-3d5y3t7f8drf35yjcj59-1]
R32  10k  [PCB-3d5y3t7f8drf35yjcj59-1]
U15  NC7SZU04  [PCB-wxeqetr75037g92pbgyq-1]
U16  NC7SZU04  [PCB-wxeqetr75037g92pbgyq-1]
U17  NC7SZ32P5X  [PCB-eypsu81inaog57bsahf2-1]
U18  NC7SZU04  [PCB-wxeqetr75037g92pbgyq-1]
U19  NC7SZU04  [PCB-wxeqetr75037g92pbgyq-1]
U20  NC7SZU04  [PCB-wxeqetr75037g92pbgyq-1]
X1  22.5792 Mhz  [PCB-5cl8jn5un4pdqd8b4poj-1]
X2  24.576 Mhz  [PCB-5cl8jn5un4pdqd8b4poj-1]

### Ports
A_MCK (out), A_OSC_SELECT (in), DAC_MCK (out), DISABLE_OSC_22 (in), DISABLE_OSC_22 (out), DISABLE_OSC_24 (in), DISABLE_OSC_24 (out), OUT_22MHZ (in), OUT_22MHZ (out), OUT_24MHZ (in), OUT_24MHZ (out)

### Nets
AGND: C67.2 C68.1 C69.1 C70.2 C71.2 C72.2 C73.2 C74.1 C75.2 C76.2 C112.2 C113.2 Q1.E Q2.E U15.3(GND) U16.3(GND) U17.3(GND) U18.3(GND) U19.3(GND) U20.3(GND) X1.2(gnd) X1.4(gnd) X2.2(gnd) X2.4(gnd)
AVCC_OSC: C67.1 C68.2 C69.2 C72.1 C73.1 C74.2 C112.1 C113.1 U15.5(VCC) U16.5(VCC) U17.5(VCC) U18.5(VCC) U19.5(VCC) U20.5(VCC)
A_MCK: R29.1 ; port A_MCK
A_OSC_SELECT: R28.2 U18.2(A) ; port DISABLE_OSC_22, port A_OSC_SELECT
DAC_MCK: R30.1 ; port DAC_MCK
DISABLE_OSC_24: R32.2 U18.4(Y) ; port DISABLE_OSC_24
OUT_22MHZ: U16.4(Y) U17.1(A) ; port OUT_22MHZ
OUT_24MHZ: U17.2(B) U20.4(Y) ; port OUT_24MHZ
NetC70_1: C70.1 R27.1 U15.4(Y) X1.1
NetC71_1: C71.1 Q1.C R27.2 U15.2(A) U16.2(A) X1.3
NetC75_1: C75.1 R31.1 U19.4(Y) X2.1
NetC76_1: C76.1 Q2.C R31.2 U19.2(A) U20.2(A) X2.3
NetQ1_B: Q1.B R28.1
NetQ2_B: Q2.B R32.1
NetR29_2: R29.2 R30.2 U17.4(Y)

### Notes on the sheet
- Disabling any oscillator will block OR gate... change U16 and U20 for buffers NC7SZ125M5X.
- Title
- Size:
- Date:
- A4
- Number:
- Time:
- Revision:
- Sheet
- of
- File:
- (in symbol CMP-a7446b0f29ac7883-1) GND

### Library data of the parts
C67-C76 C112 C113 = CMP-x8hddryxw4o380xfi98v-3: Generic Capacitor 0603; CustomComponentID: x8hddryxw4o380xfi98v
  C67-C69 C72-C74: LCSC Part #: C14663; LCSC Part #: C109474; LCSC Part #: C19702
  C70 C71 C75 C76: LCSC Part #: C1679
  C112 C113: LCSC Part #: C59461
Q1 Q2 = CMP-856282-3: TRANS NPN 45V 0.1A SOT23; Manufacturer Part Number: BC847B,215; Lead-Free Status: Lead Free; OctopartID: a1e8687d65cd7e2f; Octopart Url: https://octopart.com/bc847b%2C215-nxp+semiconductors-10477891; Number of Pins: 3; REACH SVHC Compliance: No SVHC; Lifecycle Status: Active; Polarity: NPN; RoHS: Compliant; Mounting Style: Surface Mount
R27-R32 = CMP-xcu3s4ikiffkkgbeyow5-1: Resistor 0603; CustomComponentID: xcu3s4ikiffkkgbeyow5
  R27 R31: LCSC Part #: C22935
  R28 R32: LCSC Part #: C25804
  R29 R30: LCSC Part #: C23345
U15 U16 U18-U20 = CMP-4ef282fea2d39135-3: NC7SZU04 Series 5.5 V SMT Tinny Logic UHS Unbuffered Inverter - SOT-23-5; Manufacturer Part Number: NC7SZU04M5X; Number of Circuits: 1; Output Current: 16.0 mA; Supply Voltage (DC): 5.50 V (max), 1.65 V (min); Lead-Free Status: Lead Free; Operating Temperature: -40.0 °C (min); Number of Pins: 5; RoHS: Compliant; OctopartID: 4ef282fea2d39135; Octopart URL: https://octopart.com/nc7szu04m5x-on+semiconductor-84330823; Mounting Style: Surface Mount; REACH SVHC Compliance: No SVHC; Number of Gates: 1; Case/Package: SOT-23; Packaging: Cut Tape (CT); Lifecycle Status: Active
U17 = CMP-5a21962db65b85e6-2: NC7SZ32 Series 5.5 V Surface Mount TinyLogic®UHS 2-Input OR Gate - SC-70-5
X1 X2 = CMP-a7446b0f29ac7883-1: Crystal 18.432MHz ±20ppm (Tol) ±30ppm (Stability) 18pF FUND 80Ohm 4-Pin Mini-CSMD T/R

## Sheet CS4398_DAC.SchDoc: CS4398 DAC
size A4; DocumentNumber: 7; SheetNumber: 7; SheetTotal: 8
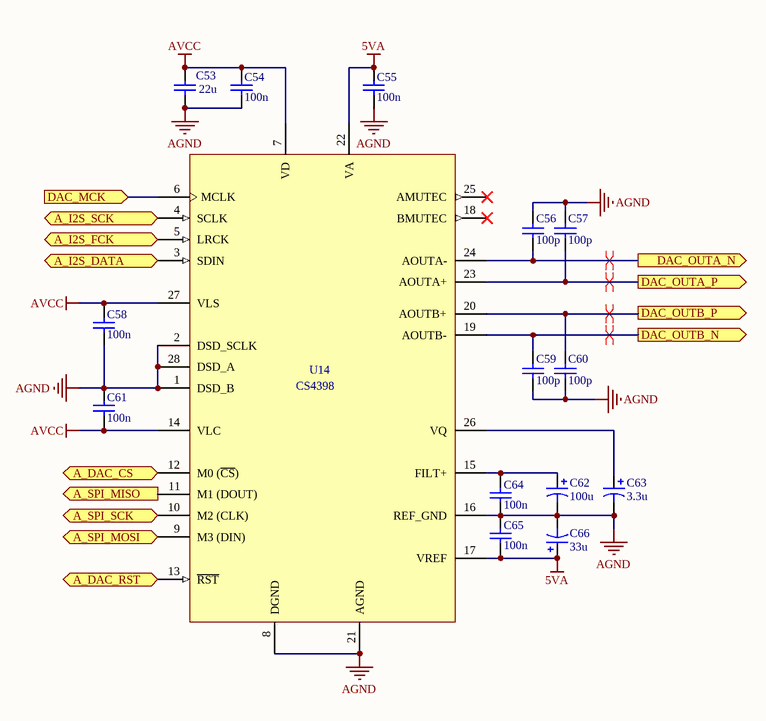
[diagram p6: CS4398_DAC.SchDoc]

### Parts
C53  22u  [PCB-rf0pzaa82dpbeu9l4sxm-1]
C54  100n  [PCB-rf0pzaa82dpbeu9l4sxm-1]
C55  100n  [PCB-rf0pzaa82dpbeu9l4sxm-1]
C56  100p  [C0402_B]
C57  100p  [C0402_B]
C58  100n  [PCB-rf0pzaa82dpbeu9l4sxm-1]
C59  100p  [C0402_B]
C60  100p  [C0402_B]
C61  100n  [PCB-rf0pzaa82dpbeu9l4sxm-1]
C62  100u  [PCB-9bfrndi9huxo1n7cihpl-1]
C63  3.3u  [PCB-3kuidc2n9u2t7zucpvy0-1]
C64  100n  [PCB-rf0pzaa82dpbeu9l4sxm-1]
C65  100n  [PCB-rf0pzaa82dpbeu9l4sxm-1]
C66  33u  [PCB-3kuidc2n9u2t7zucpvy0-1]
U14  CS4398  [PCB-b46ddvbc1rxbl1gahzd1-1]

### Ports
A_DAC_CS (in), A_DAC_RST (in), A_I2S_DATA (in), A_I2S_FCK (in), A_I2S_SCK (in), A_SPI_MISO (out), A_SPI_MOSI (in), A_SPI_SCK (in), DAC_MCK (in), DAC_OUTA_N (out), DAC_OUTA_P (out), DAC_OUTB_N (out), DAC_OUTB_P (out)

### Nets
5VA: C55.1 C65.2 C66.1 U14.17(VREF) U14.22(VA)
AGND: C53.1 C54.2 C55.2 C56.1 C57.1 C58.2 C59.2 C60.2 C61.1 C62.2 C63.2 C64.2 C65.1 C66.2 U14.1(DSD_B) U14.2(DSD_SCLK) U14.8(DGND) U14.16(REF_GND) U14.21(AGND) U14.28(DSD_A)
AVCC: C53.2 C54.1 C58.1 C61.2 U14.7(VD) U14.14(VLC) U14.27(VLS)
A_DAC_CS: U14.12(M0_(~{CS})) ; port A_DAC_CS
A_DAC_RST: U14.13(~{RST}) ; port A_DAC_RST
A_I2S_DATA: U14.3(SDIN) ; port A_I2S_DATA
A_I2S_FCK: U14.5(LRCK) ; port A_I2S_FCK
A_I2S_SCK: U14.4(SCLK) ; port A_I2S_SCK
A_SPI_MISO: U14.11(M1_(DOUT)) ; port A_SPI_MISO
A_SPI_MOSI: U14.9(M3_(DIN)) ; port A_SPI_MOSI
A_SPI_SCK: U14.10(M2_(CLK)) ; port A_SPI_SCK
DAC_MCK: U14.6(MCLK) ; port DAC_MCK
DAC_OUTA_N: C56.2 U14.24(AOUTA-) ; port DAC_OUTA_N
DAC_OUTA_P: C57.2 U14.23(AOUTA+) ; port DAC_OUTA_P
DAC_OUTB_N: C59.1 U14.19(AOUTB-) ; port DAC_OUTB_N
DAC_OUTB_P: C60.1 U14.20(AOUTB+) ; port DAC_OUTB_P
NetC62_1: C62.1 C64.1 U14.15(FILT+)
NetC63_1: C63.1 U14.26(VQ)

Not connected (* = marked no-connect by the designer): U14 18(BMUTEC)* 25(AMUTEC)*

### Layout directives
differential pair: DAC_OUTA_N, DAC_OUTA_P, DAC_OUTB_N, DAC_OUTB_P

### Notes on the sheet
- Title
- Size:
- Date:
- A4
- Number:
- Time:
- Revision:
- Sheet
- of
- File:

### Library data of the parts
C53-C55 C58 C61 C64 C65 = CMP-x8hddryxw4o380xfi98v-3: Generic Capacitor 0603; LCSC Part #: C19702
  C53: LCSC Part #: C59461; LCSC Part #: C25804; LCSC Part #: C21190; LCSC Part #: C81598
  C54 C55 C58 C61 C64 C65: CustomComponentID: x8hddryxw4o380xfi98v; LCSC Part #: C14663; LCSC Part #: C109474
C56 C57 C59 C60 = CMP-144183-3: 0402 1 uF 10 V ±10 % Tolerance X5R SMT Multilayer Ceramic Capacitor; Manufacturer Part Number: CC0402KRX5R6BB105; Lead-Free Status: Lead Free; Capacitance: 1e-06 F; Voltage Rating (DC): 10.0 V; Capacitance Tolerance: ±10%; Packaging: Cut Tape (CT); Octopart Url: http://octopart.com/cc0402krx5r6bb105-yageo-42244620; Case/Package: 0402; Mounting Style: Surface Mount; REACH SVHC Compliance: No SVHC; RoHS: Compliant; OctopartID: a1786af61e127ebf; Dielectric Characteristic: X5R; Seller Landing  Url: https://octopart-clicks.com/click/track?country=US&ak=8157f166&sig=010a0f3&sid=5489&ppid=42244620&vpid=115208218&ct=offers; Number of Pins: 2; LCSC Part #: C1546
C62 = CMP-6546a831a81eba81-4: as C18 on sheet Power_Supply; Mounting Style: Through Hole; Size-Diameter: 6.30 mm; Size-Height: 8.00 mm; Operating Temperature: 105 °C (max); RoHS: Compliant; Manufacturer Part Number: A758EK107M1AAAE016; Octopart URL: https://octopart.com/a758ek107m1aaae016-kemet-75360318; OctopartID: 6546a831a81eba81
C63 C66 = CMP-e4c92dfab4043b0e-1: Cap Tant Solid 10uF 10V B CASE 10% (3.5 X 2.8 X 1.9mm) Inward L SMD 3528-21 2.5 Ohm 125C T/R; Manufacturer Part Number: TAJB106K010RNJ; Voltage Rating (DC): 10.0 V; Lead-Free Status: Lead Free; Equivalent Series Resistance (ESR): 2.50 Ω; Capacitance: 10.0 µF; Q-Factor: 6.0; Mounting Style: Surface Mount; Capacitance Tolerance: ±10%; Number of Pins: 2; RoHS: Compliant; Case/Package: 1210; Packaging: Cut Tape (CT), Tape & Reel (TR); OctopartID: e4c92dfab4043b0e; Octopart URL: http://octopart.com/tajb106k010rnj-avx-3765675; REACH SVHC Compliance: No SVHC
U14 = CMP-031cca108660dcdb-1: DAC 2-CH Delta-Sigma 24-bit 28-Pin TSSOP Rail; Manufacturer Part Number: CS4398-CZZ; Lead-Free Status: Lead Free; Number of Bits: 24; Power Dissipation: 340 mW (max); Sample Rate: 192 kHz; Supply Current: 25.0 mA; Supply Voltage (DC): 5.25 V (max), 5.00 V; Octopart URL: https://octopart.com/cs4398-czz-cirrus+logic-434202; Case/Package: TSSOP; Mounting Style: Surface Mount; Operating Temperature: 70.0 °C (max); Packaging: Tube; Number of Pins: 28; RoHS: Compliant; OctopartID: 031cca108660dcdb

## Sheet Audio_Output.SchDoc: Audio Output
size A4; DocumentNumber: 8; SheetNumber: 8; SheetTotal: 8
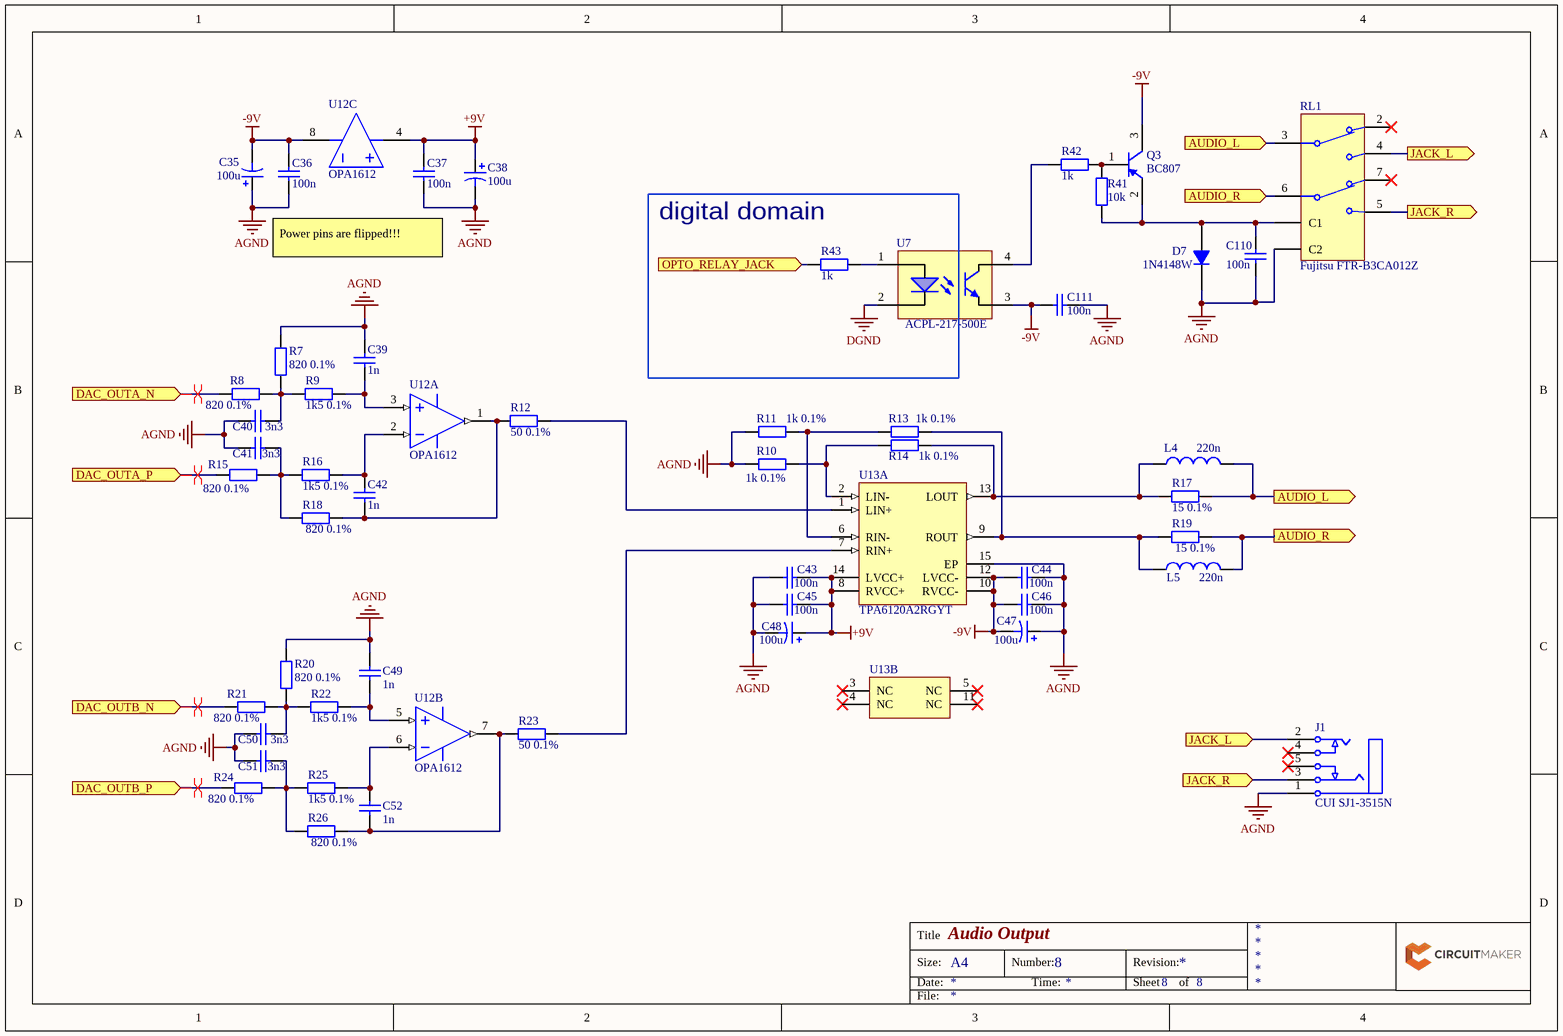
[diagram p7: Audio_Output.SchDoc]

### Parts
C35  100u  [PCB-9bfrndi9huxo1n7cihpl-1]
C36  100n  [PCB-rf0pzaa82dpbeu9l4sxm-1]
C37  100n  [PCB-rf0pzaa82dpbeu9l4sxm-1]
C38  100u  [PCB-9bfrndi9huxo1n7cihpl-1]
C39  1n  [PCB-rf0pzaa82dpbeu9l4sxm-1]
C40  3n3  [PCB-rf0pzaa82dpbeu9l4sxm-1]
C41  3n3  [PCB-rf0pzaa82dpbeu9l4sxm-1]
C42  1n  [PCB-rf0pzaa82dpbeu9l4sxm-1]
C43  100n  [PCB-rf0pzaa82dpbeu9l4sxm-1]
C44  100n  [PCB-rf0pzaa82dpbeu9l4sxm-1]
C45  100n  [PCB-rf0pzaa82dpbeu9l4sxm-1]
C46  100n  [PCB-rf0pzaa82dpbeu9l4sxm-1]
C47  100u  [PCB-9bfrndi9huxo1n7cihpl-1]
C48  100u  [PCB-9bfrndi9huxo1n7cihpl-1]
C49  1n  [PCB-rf0pzaa82dpbeu9l4sxm-1]
C50  3n3  [PCB-rf0pzaa82dpbeu9l4sxm-1]
C51  3n3  [PCB-rf0pzaa82dpbeu9l4sxm-1]
C52  1n  [PCB-rf0pzaa82dpbeu9l4sxm-1]
C110  100n  [PCB-rf0pzaa82dpbeu9l4sxm-1]
C111  100n  [PCB-rf0pzaa82dpbeu9l4sxm-1]
D7  1N4148W  [PCB-dk2zqfkr0dm389ntik9k-1]
J1  CUI SJ1-3515N  [PCB-j9vj6bmn4rccphvinwcn-1]
L4  220n  [PCB-0z5abqka5wqo6pkabrtd-1]
L5  220n  [PCB-0z5abqka5wqo6pkabrtd-1]
Q3  BC807  [ONSC-SOT-23-3-318-08_V]
R7  820 0.1%  [PCB-3d5y3t7f8drf35yjcj59-1]
R8  820 0.1%  [PCB-3d5y3t7f8drf35yjcj59-1]
R9  1k5 0.1%  [PCB-3d5y3t7f8drf35yjcj59-1]
R10  1k 0.1%  [PCB-3d5y3t7f8drf35yjcj59-1]
R11  1k 0.1%  [PCB-3d5y3t7f8drf35yjcj59-1]
R12  50 0.1%  [PCB-3d5y3t7f8drf35yjcj59-1]
R13  1k 0.1%  [PCB-3d5y3t7f8drf35yjcj59-1]
R14  1k 0.1%  [PCB-3d5y3t7f8drf35yjcj59-1]
R15  820 0.1%  [PCB-3d5y3t7f8drf35yjcj59-1]
R16  1k5 0.1%  [PCB-3d5y3t7f8drf35yjcj59-1]
R17  15 0.1%  [PCB-3d5y3t7f8drf35yjcj59-1]
R18  820 0.1%  [PCB-3d5y3t7f8drf35yjcj59-1]
R19  15 0.1%  [PCB-3d5y3t7f8drf35yjcj59-1]
R20  820 0.1%  [PCB-3d5y3t7f8drf35yjcj59-1]
R21  820 0.1%  [PCB-3d5y3t7f8drf35yjcj59-1]
R22  1k5 0.1%  [PCB-3d5y3t7f8drf35yjcj59-1]
R23  50 0.1%  [PCB-3d5y3t7f8drf35yjcj59-1]
R24  820 0.1%  [PCB-3d5y3t7f8drf35yjcj59-1]
R25  1k5 0.1%  [PCB-3d5y3t7f8drf35yjcj59-1]
R26  820 0.1%  [PCB-3d5y3t7f8drf35yjcj59-1]
R41  10k  [PCB-3d5y3t7f8drf35yjcj59-1]
R42  1k  [PCB-3d5y3t7f8drf35yjcj59-1]
R43  1k  [PCB-3d5y3t7f8drf35yjcj59-1]
RL1  Fujitsu FTR-B3CA012Z  [PCB-79j3gj3ralb8es1cyg77-1]
U7  ACPL-217-500E  [PCB-tryrgihdrozpg2dv6q87-1]
U12  OPA1612  [TI-D8_M]  (parts A,B,C of 3)
U13  TPA6120A2RGYT  [RGY14-2050X2050TP]  (parts A,B of 2)

### Blocks framed on the sheet
digital domain: R43 U7

### Ports
AUDIO_L (in), AUDIO_L (out), AUDIO_R (in), AUDIO_R (out), DAC_OUTA_N (in), DAC_OUTA_P (in), DAC_OUTB_N (in), DAC_OUTB_P (in), JACK_L (in), JACK_L (out), JACK_R (in), JACK_R (out), OPTO_RELAY_JACK (in)

### Nets
+9V: C37.1 C38.1 C43.2 C45.2 C48.1 U12.4(V-) U13.8(RVCC+) U13.14(LVCC+)
-9V: C35.2 C36.1 C44.1 C46.1 C47.2 C111.1 Q3.3(C) U7.3 U12.8(V+) U13.10(RVCC-) U13.12(LVCC-)
AGND: C35.1 C36.2 C37.2 C38.2 C39.1 C40.1 C41.1 C43.1 C44.2 C45.1 C46.2 C47.1 C48.2 C49.2 C50.2 C51.1 C110.1 C111.2 D7.2(K) J1.1(SLEEVE) R7.2 R10.2 R11.2 R20.2 RL1.8(C2) U13.15(EP)
DGND: U7.2
AUDIO_L: L4.2 R17.2 RL1.3 ; port AUDIO_L
AUDIO_R: L5.2 R19.2 RL1.6 ; port AUDIO_R
DAC_OUTA_N: R8.2 ; port DAC_OUTA_N
DAC_OUTA_P: R15.2 ; port DAC_OUTA_P
DAC_OUTB_N: R21.2 ; port DAC_OUTB_N
DAC_OUTB_P: R24.2 ; port DAC_OUTB_P
JACK_L: J1.2(TIP) RL1.4 ; port JACK_L
JACK_R: J1.3(RING) RL1.5 ; port JACK_R
OPTO_RELAY_JACK: R43.2 ; port OPTO_RELAY_JACK
NetC39_2: C39.2 R9.2 U12.3(IN_A+)
NetC40_2: C40.2 R7.1 R8.1 R9.1
NetC41_2: C41.2 R15.1 R16.1 R18.2
NetC42_1: C42.1 R16.2 U12.2(IN_A-)
NetC42_2: C42.2 R12.1 R18.1 U12.1(OUT_A)
NetC49_1: C49.1 R22.2 U12.5(IN_B+)
NetC50_1: C50.1 R20.1 R21.1 R22.1
NetC51_2: C51.2 R24.1 R25.1 R26.2
NetC52_1: C52.1 R23.1 R26.1 U12.7(OUT_B)
NetC52_2: C52.2 R25.2 U12.6(IN_B-)
NetC110_2: C110.2 D7.1(A) Q3.2(E) R41.2 RL1.1(C1)
NetL4_1: L4.1 R14.1 R17.1 U13.13(LOUT)
NetL5_1: L5.1 R13.1 R19.1 U13.9(ROUT)
NetQ3_1: Q3.1(B) R41.1 R42.1
NetR10_1: R10.1 R14.2 U13.2(LIN-)
NetR11_1: R11.1 R13.2 U13.6(RIN-)
NetR12_2: R12.2 U13.1(LIN+)
NetR23_2: R23.2 U13.7(RIN+)
NetR42_2: R42.2 U7.4
NetR43_1: R43.1 U7.1(A)

Not connected (* = marked no-connect by the designer): J1 4* 5*; RL1 2* 7*; U13 3(NC)* 4(NC)* 5(NC)* 11(NC)*

### Layout directives
differential pair: DAC_OUTA_N, DAC_OUTA_P, DAC_OUTB_N, DAC_OUTB_P

### Notes on the sheet
- Power pins are flipped!!!
- Title
- Size:
- Date:
- A4
- Number:
- Time:
- Revision:
- Sheet
- of
- File:

### Library data of the parts
C35 C38 C47 C48 = CMP-6546a831a81eba81-4: as C18 on sheet Power_Supply; Mounting Style: Through Hole; Size-Diameter: 6.30 mm; Size-Height: 8.00 mm; Operating Temperature: 105 °C (max); RoHS: Compliant; Manufacturer Part Number: A758EK107M1AAAE016; Octopart URL: https://octopart.com/a758ek107m1aaae016-kemet-75360318; OctopartID: 6546a831a81eba81
C36 C37 C39-C46 C49-C52 C110 C111 = CMP-x8hddryxw4o380xfi98v-3: Generic Capacitor 0603; CustomComponentID: x8hddryxw4o380xfi98v
  C36 C37 C43-C46 C110 C111: LCSC Part #: C14663; LCSC Part #: C19702; LCSC Part #: C25804
D7 = CMP-791fb3587d52a6d8-24: Small Signal Diode, Single, 100 V, 300 Ma, 1.25 V, 4 Ns, 2 A Rohs Compliant: Yes; Power Dissipation: 400 mW (max); Polarity: Standard; Capacitance: 2.00 pF; Power Rating: 400 mW; REACH SVHC Compliance: No SVHC; Operating Temperature: -65.0 °C to 150 °C; OctopartID: 791fb3587d52a6d8; Number of Pins: 2; Mounting Style: Surface Mount; Lifecycle Status: Active; RoHS: Compliant; Octopart URL: https://octopart.com/1n4148w-7-f-diodes+inc.-55386411; LCSC Part #: C81598; LCSC Part #: C1546; LCSC Part #: C23265; LCSC Part #: C23345
J1 = CMP-62caabc32dc3bd0d-2: 3.5 mm Right-Angle Stereo Jack, 5 Pin PCB Mount, Non-Threaded; Lead-Free Status: Lead Free; Mounting Angle: 90.0 °; Shielding: No; Gender: Female; OctopartID: 62caabc32dc3bd0d; Contact Plating: Silver; RoHS: Compliant; Octopart URL: http://octopart.com/sj1-3515n-cui-223855; Orientation: Horizontal; Size-Diameter: 3.50 mm; Manufacturer Part Number: SJ1-3515N; Color: Black; Mounting Style: Through Hole; Lifecycle Status: Active; Packaging: Bulk
L4 L5 = CMP-2243ea3eb191fd84-1: RF inductor, air core, 2% tol, SMT, RoHS, halogen-free; Manufacturer Part Number: 2222SQ-221GEB; Current Rating: 5.00 A; Inductance: 220 nH; Lead-Free Status: Contains Lead; Q-Factor: 140.0; Self Resonant Frequency: 1.00 GHz; Octopart URL: https://octopart.com/2222sq-221geb-coilcraft-24622772; Lifecycle Status: Active; Mounting Style: Surface Mount; Packaging: Cut Tape (CT); REACH SVHC Compliance: No SVHC; RoHS: Compliant; OctopartID: 2243ea3eb191fd84
Q3 = CMP-857821-2: General Purpose Transistor, PNP Silicon, 3-Pin SOT-23, Pb-Free, Tape and Reel; Manufacturer Part Number: BC807-16LT1G; Lead-Free Status: Lead Free; Case/Package: SOT-23-3; Halogen Free Status: Halogen Free; Lifecycle Status: Active; Mounting Style: Surface Mount; Number of Pins: 3; Octopart Url: https://octopart.com/bc807-16lt1g-on+semiconductor-46514747; OctopartID: afbd647248e0707a; Polarity: PNP; REACH SVHC Compliance: No SVHC; RoHS: Compliant
R7-R26 R41-R43 = CMP-xcu3s4ikiffkkgbeyow5-1: Resistor 0603; CustomComponentID: xcu3s4ikiffkkgbeyow5
  R41: LCSC Part #: C25804; LCSC Part #: C21190
  R42 R43: LCSC Part #: C21190
RL1 = CMP-2945e043254ff682-1: Miniature Relay 2A, coil voltage 12V DC, 2 changeover contact (2C), 1A/30V DC, 0.3A/125VAC; Coil Voltage: 12.0 V; Contacts Type: DPDT; Power Consumption: 140 mW; Octopart URL: https://octopart.com/ftr-b3ca012z-fujitsu-797036; Manufacturer Part Number: FTR-B3CA012Z; Mounting Style: PCB; RoHS: Compliant; OctopartID: 2945e043254ff682
U7 = CMP-7a61b307eb6fa5a6-3: Optocoupler; SMD; Channels: 1; Out: transistor; 3kV; SO4; Power Dissipation: 200 mW; Lead-Free Status: Lead Free; Isolation Voltage: 3.00 kV; Output Voltage: 80.0 V; Input Current: 20.0 mA; Packaging: Tape & Reel (TR), Cut Tape (CT); REACH SVHC Compliance: No SVHC; RoHS: Compliant; Number of Pins: 4; Lifecycle Status: Active; Case/Package: SOIC; Mounting Style: Surface Mount; Manufacturer Part Number: ACPL-217-500E; Octopart URL: http://octopart.com/acpl-217-500e-avago-7124072; OctopartID: 7a61b307eb6fa5a6
U12 = CMP-1335515-4: 1.1 nV/rtHz Noise, Low Power, Precision Operational Amplifier, 4.5 to 36 V, -40 to 85 degC, 8-pin SOIC (D8), Green (RoHS & no Sb/Br); Manufacturer Part Number: OPA1612AIDR; Lead-Free Status: Lead Free; Gain Bandwidth Product: 40000000.0 Hz; Input Offset Drift: 1e-06 V/K; Slew Rate: 27.0 V/μs; Number of Channels: 2; Octopart Url: https://octopart.com/opa1612aidr-texas+instruments-12192553; OctopartID: f9273097d76826e0; Case/Package: SOIC; RoHS: Compliant; Number of Pins: 8; Lifecycle Status: Active
U13 = CMP-19855737-3: HEADPHONE AMP, CLASS AB, VQFN-14; Lead-Free Status: Lead Free; Output Power: 1.5 W; Manufacturer Part Number: TPA6120A2RGYT; Lifecycle Status: Active; Number of Pins: 14; Octopart Url: https://octopart.com/tpa6120a2rgyt-texas+instruments-47324054; OctopartID: 08efc337361fd728; Packaging: Cut Tape (CT); REACH SVHC Compliance: No SVHC; RoHS: Compliant

## Nets that join several sheets
5VA: Power_Supply (C17.2 C18.1 U3.9 U3.10), CS4398_DAC (5 pins)
+5V: Power_Supply (11 pins), Comm_Interface (C28.2 C34.2 U8.5 U11.5)
+9V: Power_Supply_9V (5 pins), Audio_Output (8 pins)
+10V: Power_Supply (11 pins), Power_Supply_9V (7 pins)
-9V: Power_Supply_9V (5 pins), Audio_Output (11 pins)
-10V: Power_Supply (C12.1 C13.2 L3.2), Power_Supply_9V (6 pins)
AGND: Power_Supply (37 pins), Power_Supply_9V (18 pins), Comm_Interface (5 pins), MCLK_Oscillator (24 pins), CS4398_DAC (20 pins), Audio_Output (26 pins)
AVCC: Power_Supply (C21.2 U5.5), Comm_Interface (5 pins), CS4398_DAC (7 pins)
AVCC_OSC: Power_Supply (5 pins), MCLK_Oscillator (14 pins)
DGND: Power_Supply (10 pins), Comm_Interface (9 pins), MCU_System (47 pins), MCU_GPIO (9 pins), Audio_Output (U7.2)
USB_VBUS: Power_Supply (C3.2 L1.1), MCU_System (J4.1 U21.29 U23.4)
VCC: Power_Supply (C15.2 U2.5), Comm_Interface (C29.2 C31.2 U9.1 U10.1), MCU_System (25 pins), MCU_GPIO (J2.2 J3.2)
!DCDC_EN: Comm_Interface (R6.1 U11.2), MCU_GPIO (U21.57)
!DCDC_EN_5V: Power_Supply (U1.5), Comm_Interface (U11.4)
A_DAC_CS: Comm_Interface (U10.14), CS4398_DAC (U14.12)
A_DAC_RST: Comm_Interface (U10.15), CS4398_DAC (U14.13)
A_I2S_DATA: Comm_Interface (R4.1), CS4398_DAC (U14.3)
A_I2S_FCK: Comm_Interface (R3.1), CS4398_DAC (U14.5)
A_I2S_SCK: Comm_Interface (R2.1), CS4398_DAC (U14.4)
A_MCK: Comm_Interface (U9.11), MCLK_Oscillator (R29.1)
A_OSC_SELECT: Comm_Interface (U9.15), MCLK_Oscillator (R28.2 U18.2)
A_SPI_MISO: Comm_Interface (U10.11), CS4398_DAC (U14.11)
A_SPI_MOSI: Comm_Interface (U10.12), CS4398_DAC (U14.9)
A_SPI_SCK: Comm_Interface (U10.13), CS4398_DAC (U14.10)
D_DAC_CS: Comm_Interface (U10.3), MCU_GPIO (U21.80)
D_DAC_RST: Comm_Interface (U10.2), MCU_GPIO (U21.79)
D_I2S_DATA: Comm_Interface (U9.5), MCU_GPIO (U21.9)
D_I2S_FCK: Comm_Interface (U9.4), MCU_GPIO (U21.5)
D_I2S_SCK: Comm_Interface (U9.3), MCU_GPIO (U21.6)
D_MCK: Comm_Interface (R5.2), MCU_GPIO (U21.4 U21.55)
D_OSC_SELECT: Comm_Interface (U9.2), MCU_GPIO (U21.8)
D_SPI_MISO: Comm_Interface (U10.6), MCU_GPIO (U21.3)
D_SPI_MOSI: Comm_Interface (U10.5), MCU_GPIO (U21.2)
D_SPI_SCK: Comm_Interface (U10.4), MCU_GPIO (U21.1)
DAC_MCK: MCLK_Oscillator (R30.1), CS4398_DAC (U14.6)
DAC_OUTA_N: CS4398_DAC (C56.2 U14.24), Audio_Output (R8.2)
DAC_OUTA_P: CS4398_DAC (C57.2 U14.23), Audio_Output (R15.2)
DAC_OUTB_N: CS4398_DAC (C59.1 U14.19), Audio_Output (R21.2)
DAC_OUTB_P: CS4398_DAC (C60.1 U14.20), Audio_Output (R24.2)
DCDC_CLK: Comm_Interface (U8.2), MCU_GPIO (U21.56)
DCDC_CLK_5V: Power_Supply (U1.6), Comm_Interface (U8.4)
IMX_ONOFF: MCU_System (U21.21), MCU_GPIO (J5.1)
OPTO_RELAY_JACK: MCU_GPIO (U21.10), Audio_Output (R43.2)
SMEM_CS: MCU_System (R44.1 U22.1), MCU_GPIO (U21.69)
SMEM_IO0: MCU_System (U22.5), MCU_GPIO (U21.66)
SMEM_IO1: MCU_System (U22.2), MCU_GPIO (U21.68)
SMEM_IO2: MCU_System (U22.3), MCU_GPIO (U21.67)
SMEM_IO3: MCU_System (U22.7), MCU_GPIO (U21.64)
SMEM_SCK: MCU_System (U22.6), MCU_GPIO (U21.65)